# EAGLE board Clocks_Freq_Synth_board (EAGLE 9.6.2)
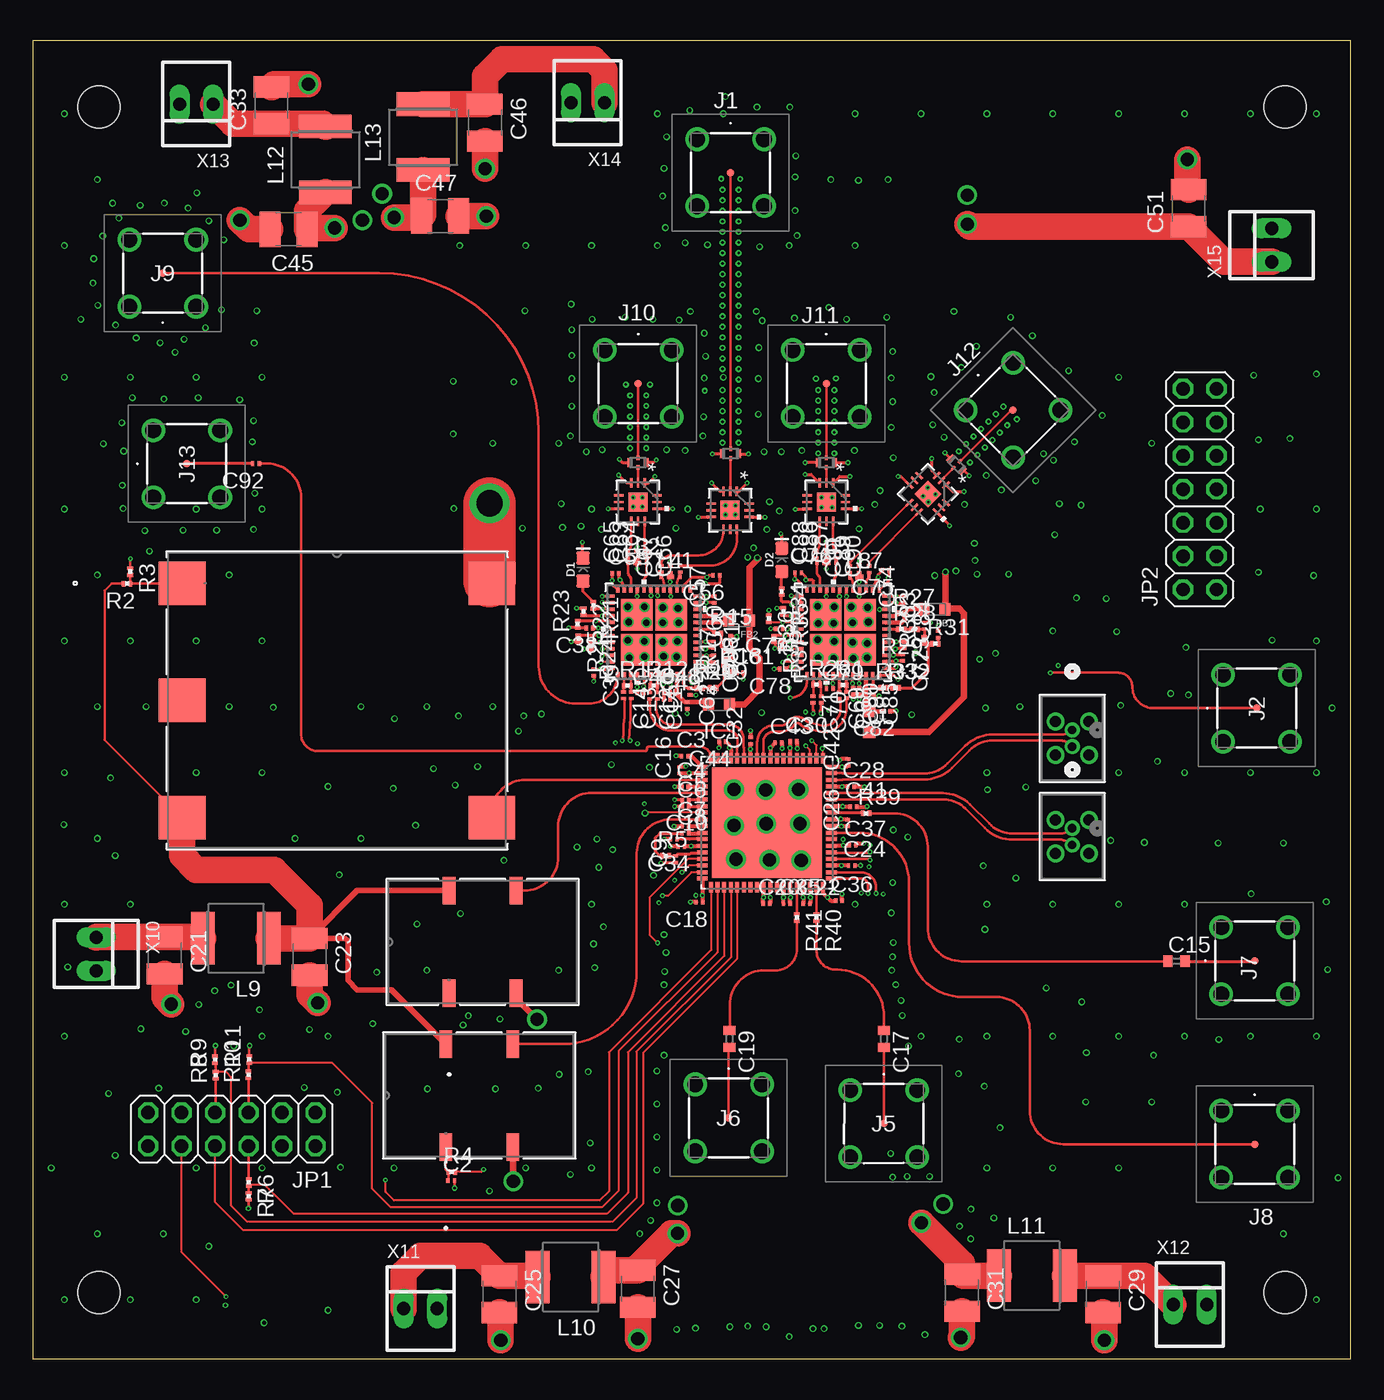
[diagram p3: board, top side]
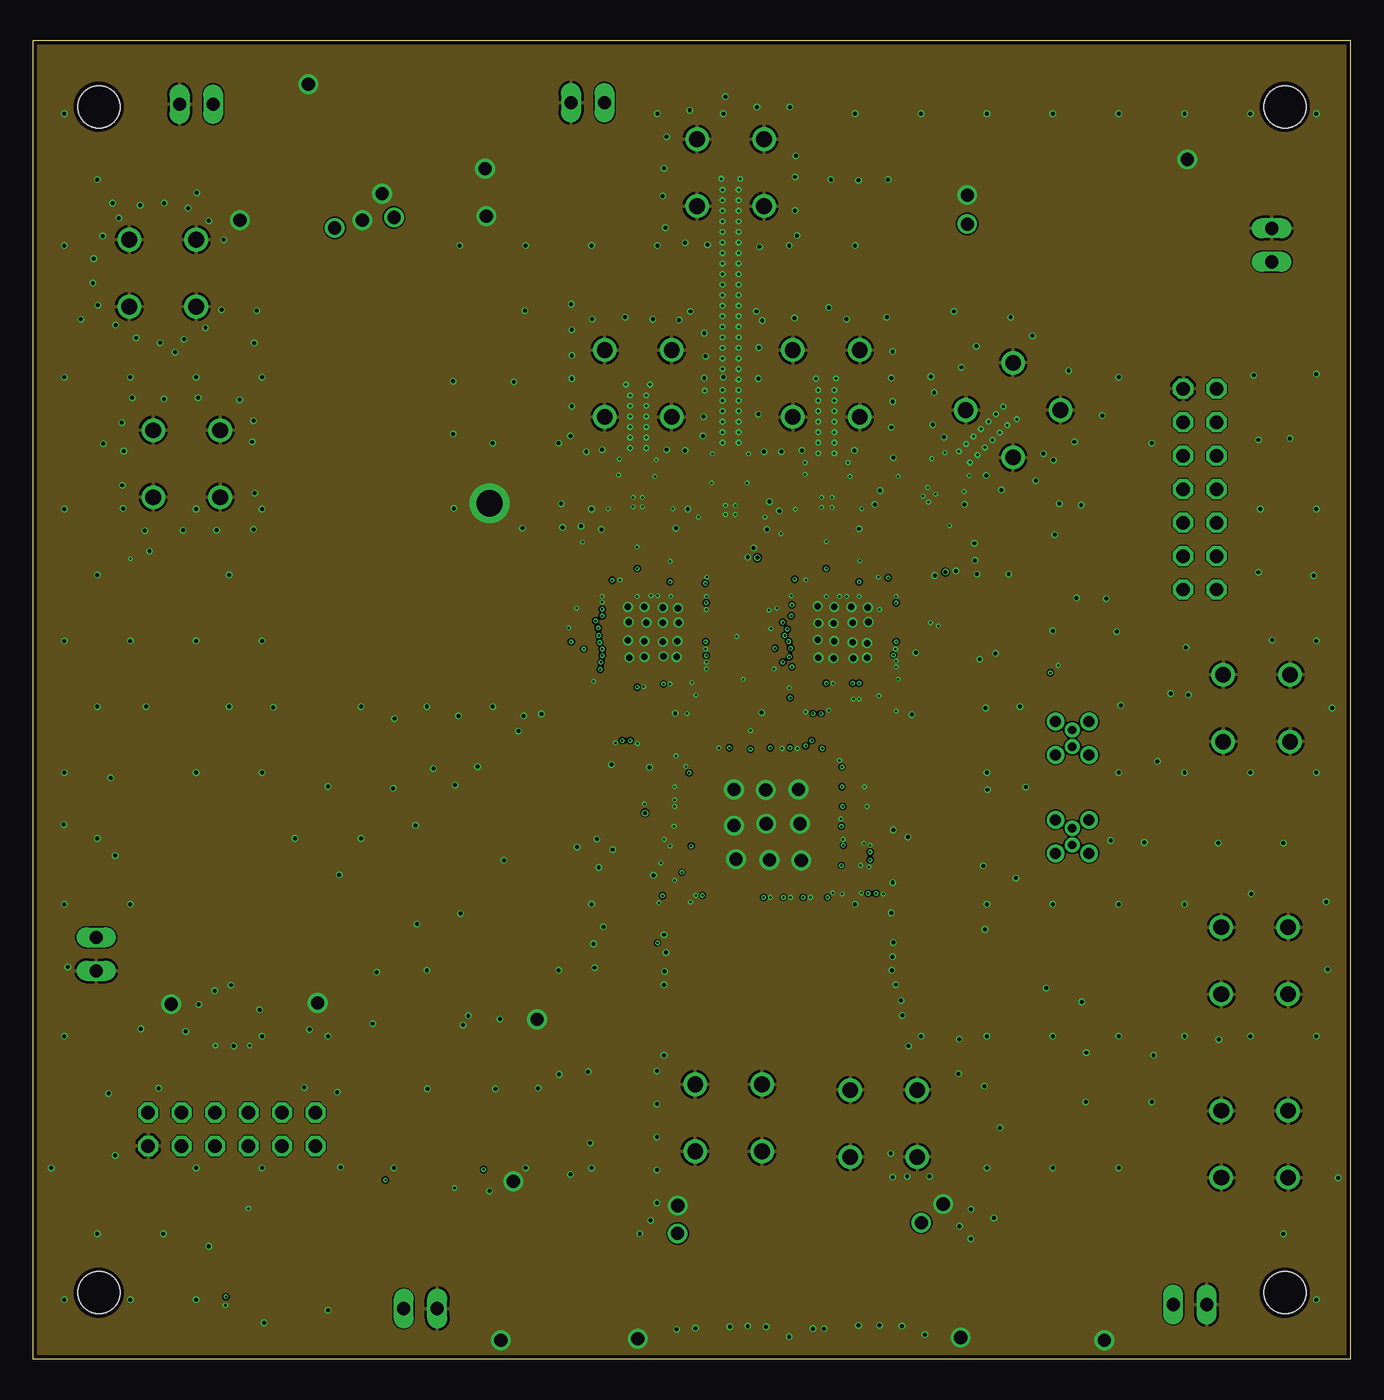
[diagram p4: board, inner layer Route2]
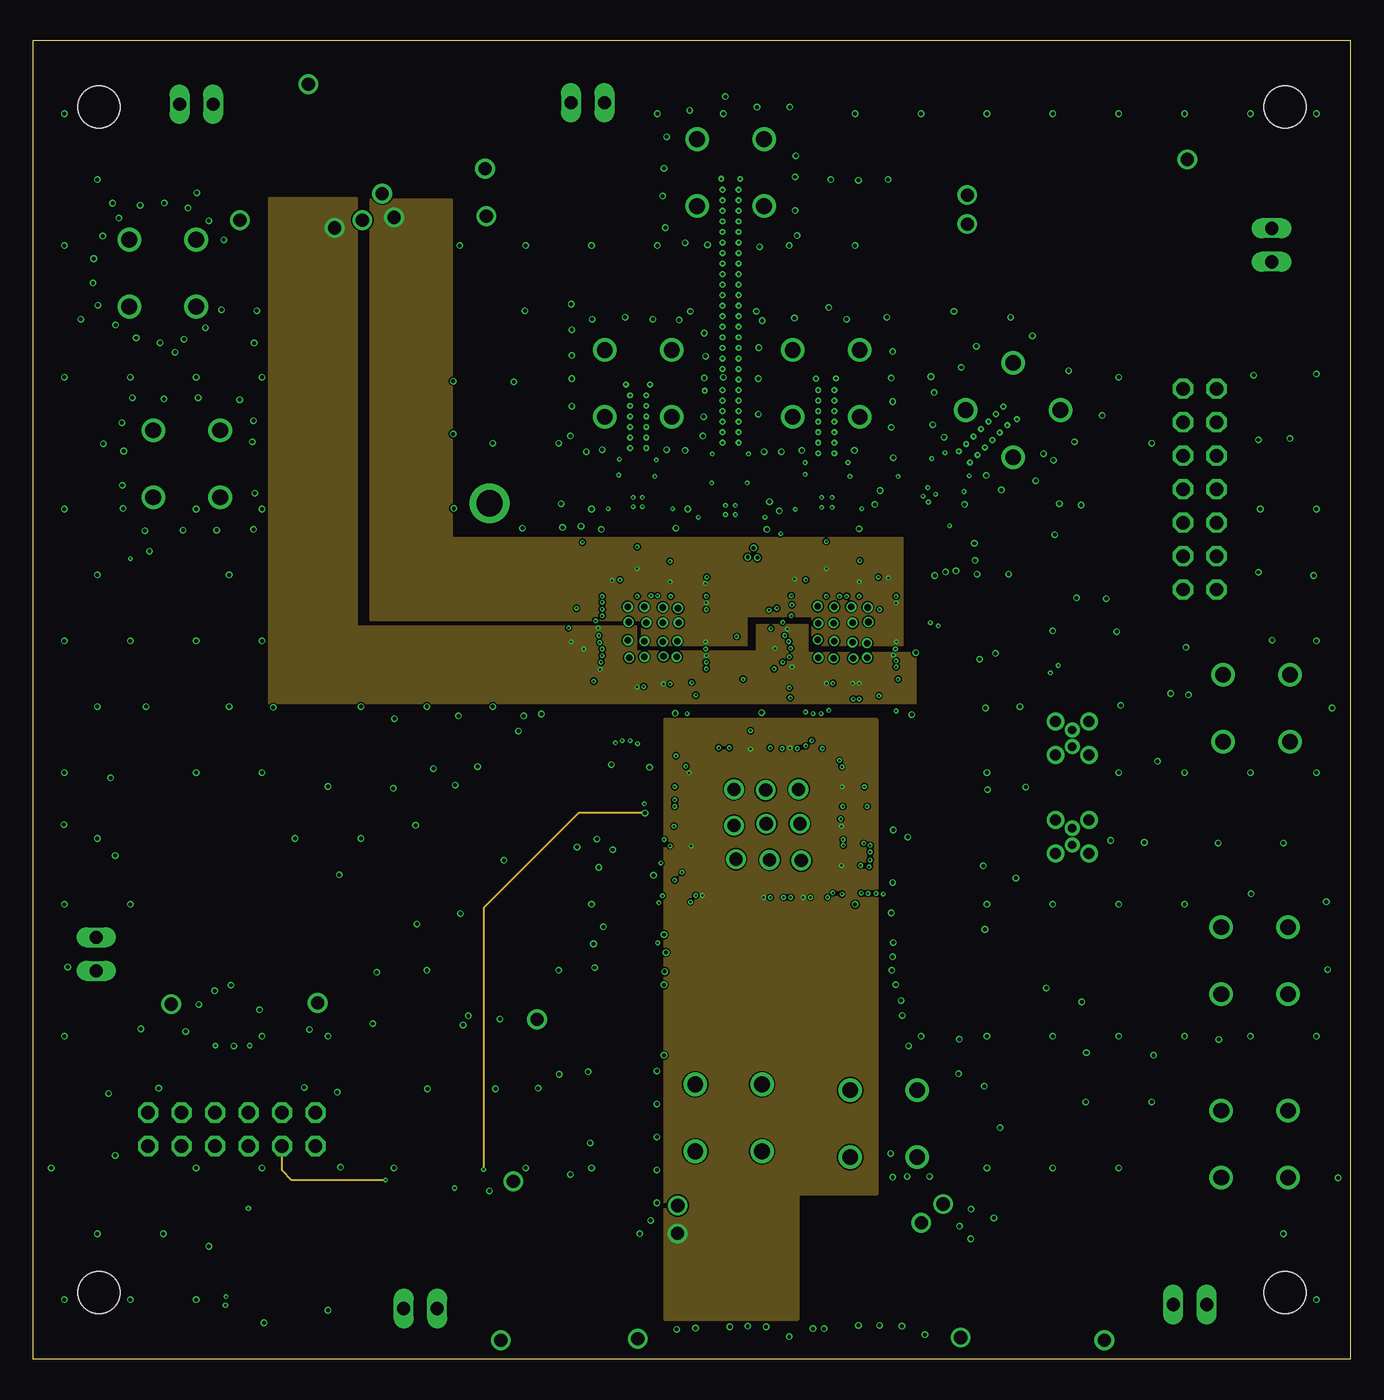
[diagram p5: board, inner layer Route3]
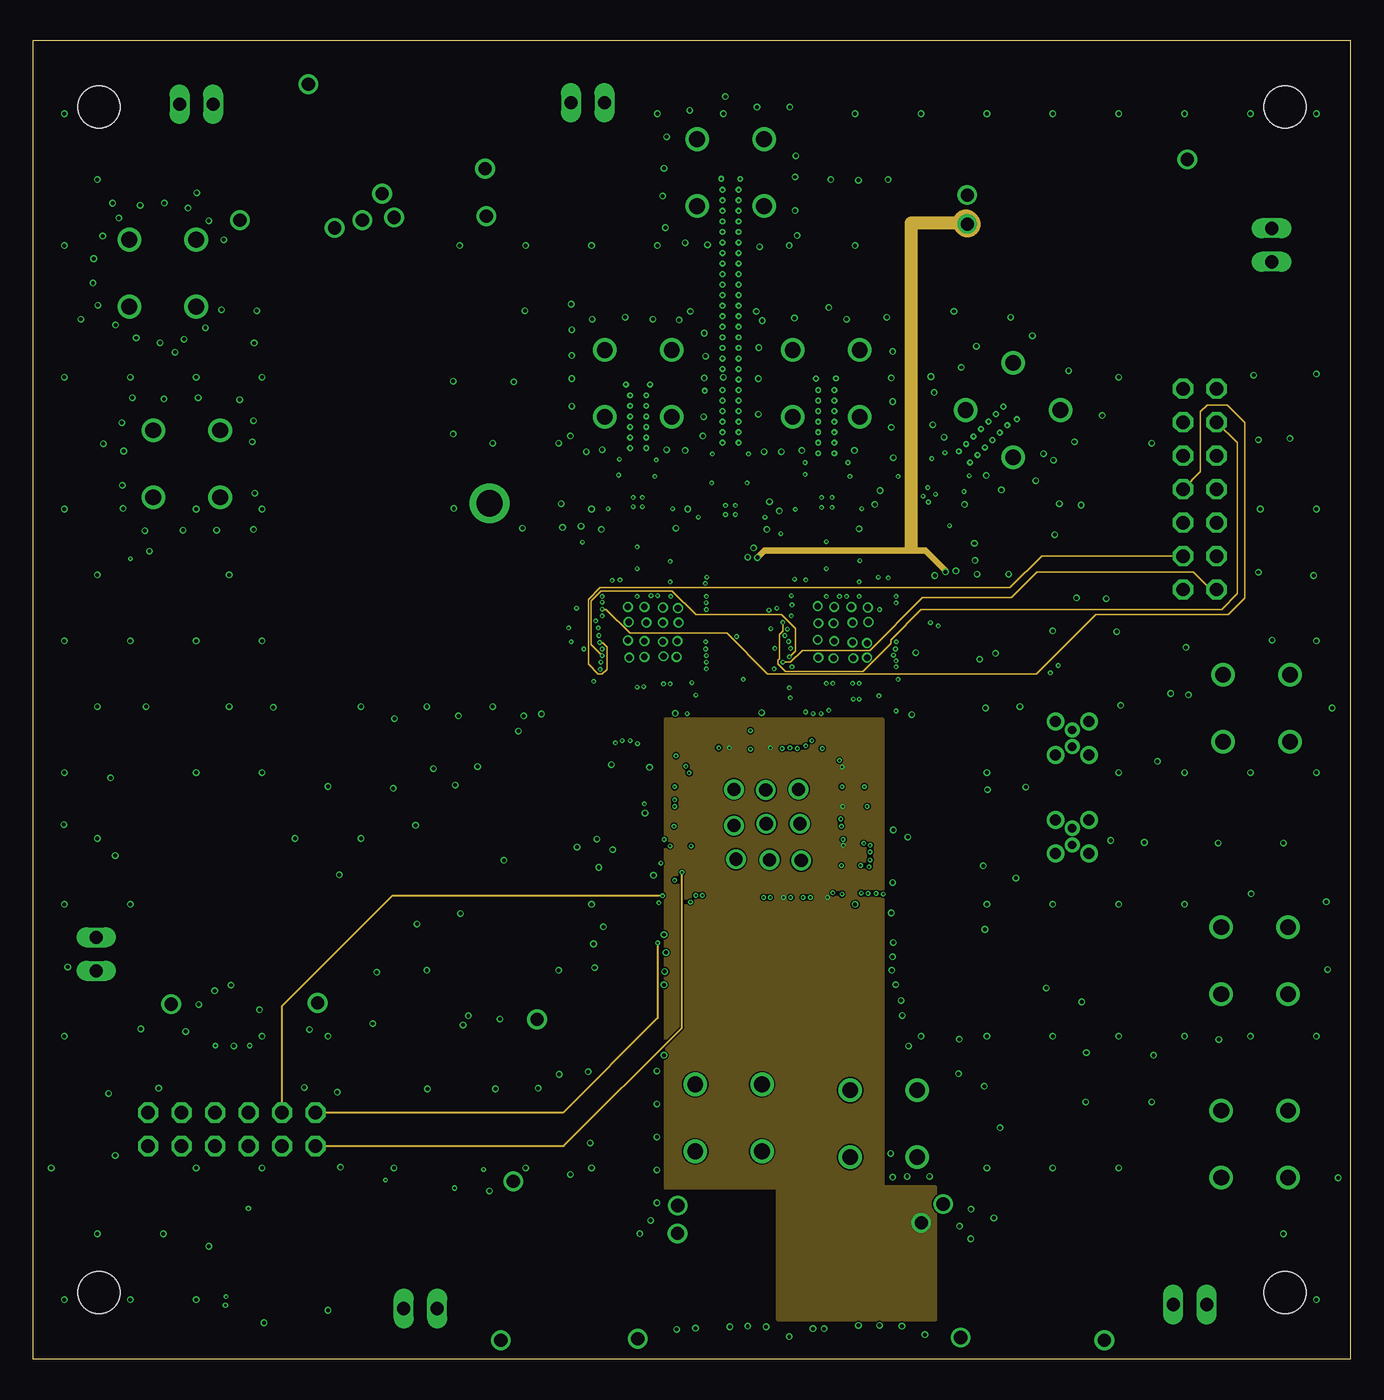
[diagram p6: board, inner layer Route14]
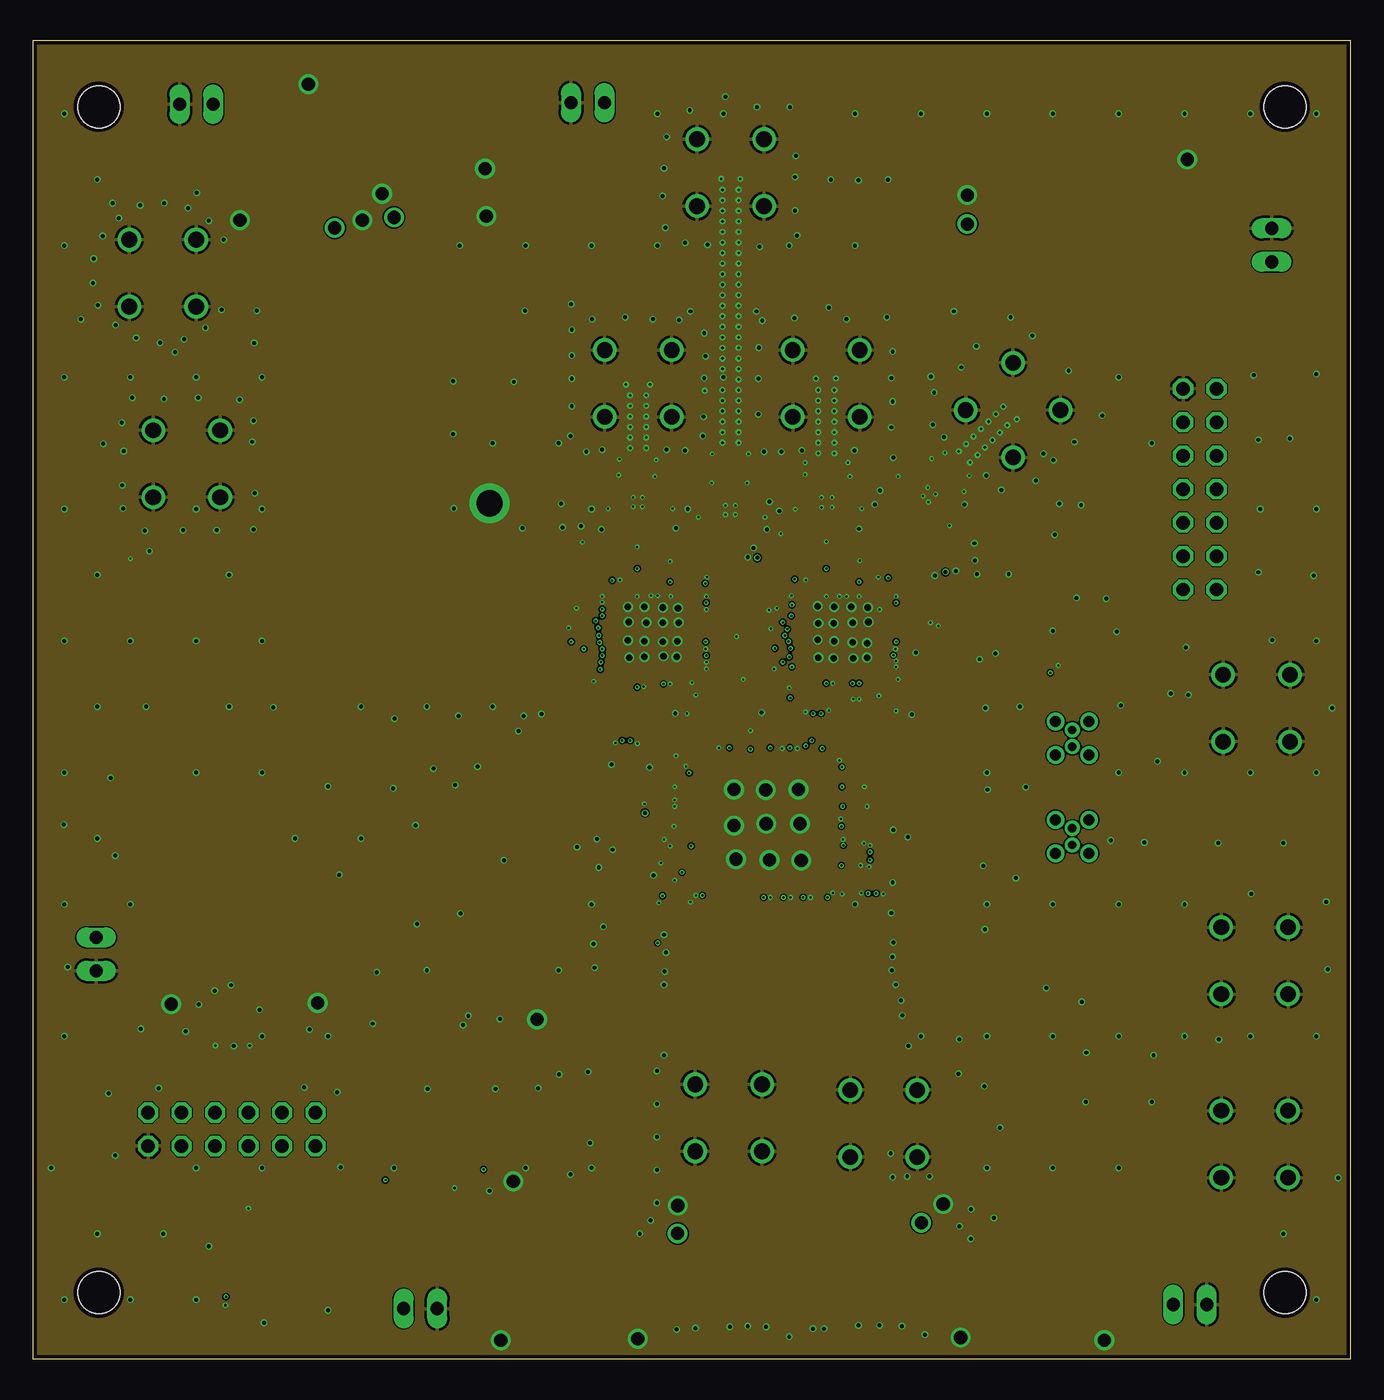
[diagram p7: board, inner layer Route15]
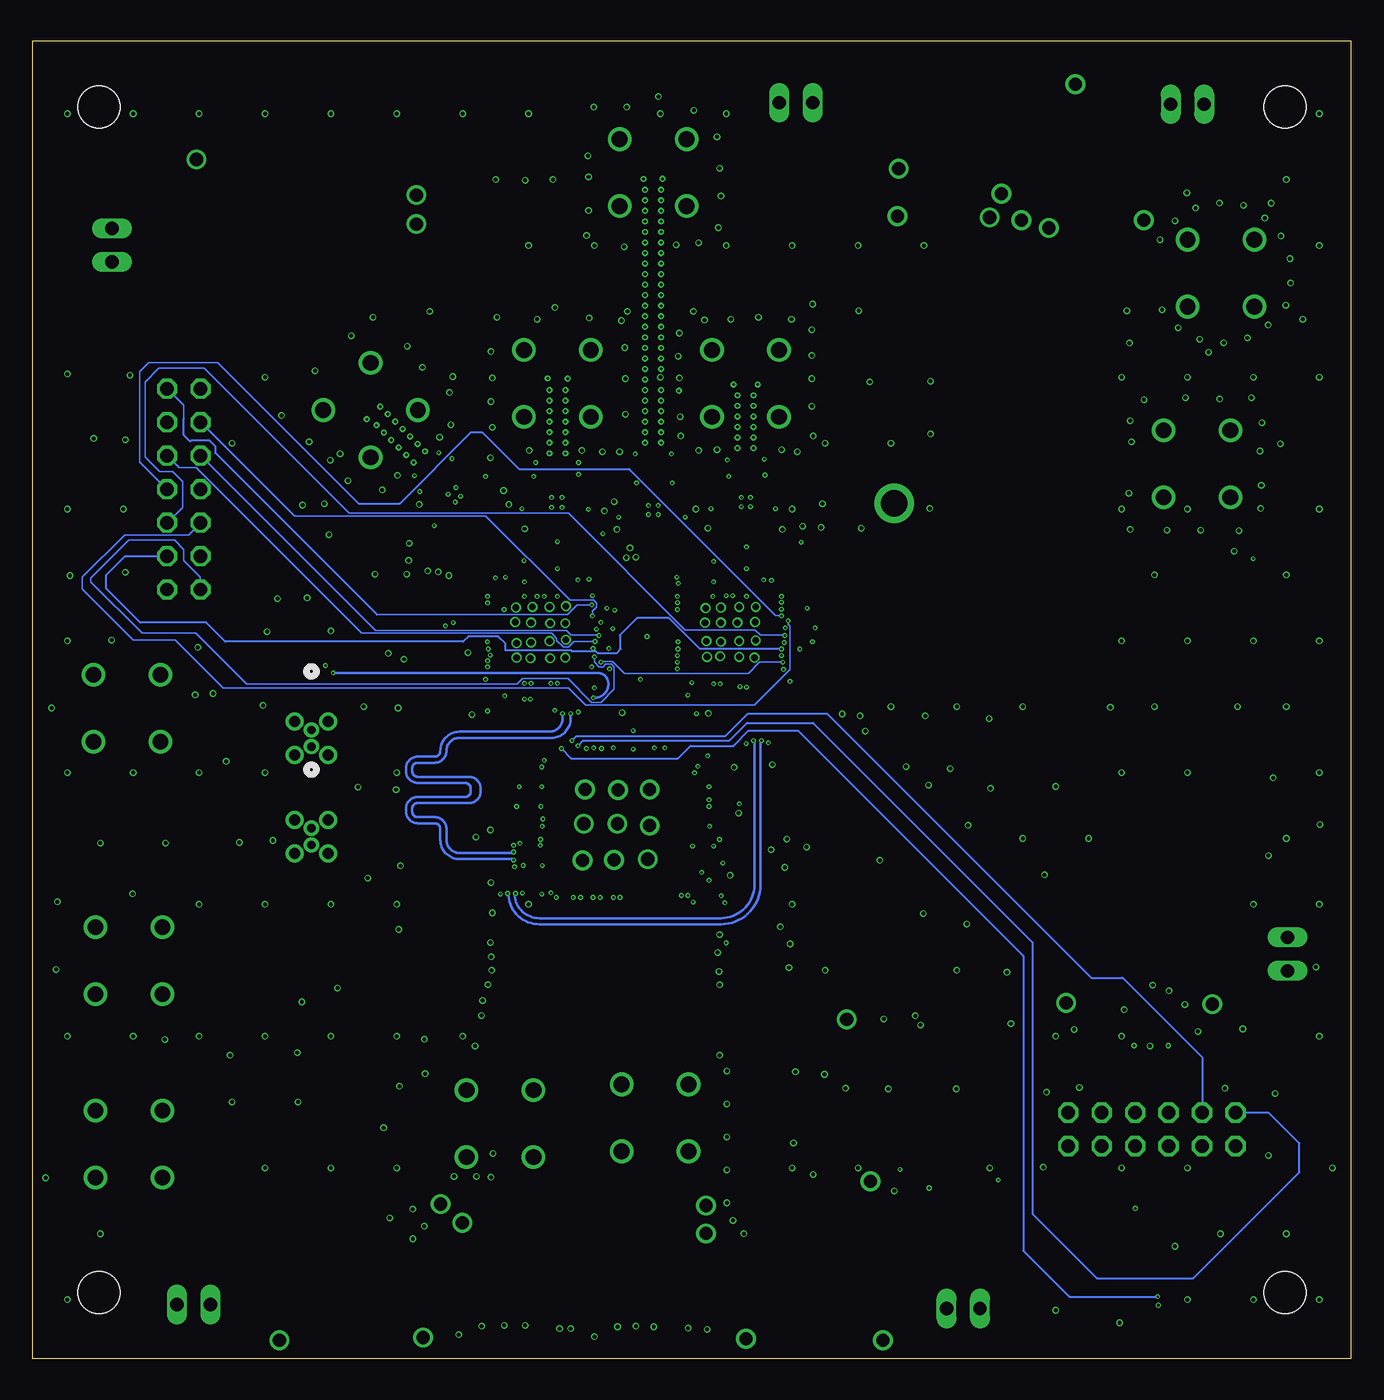
[diagram p8: board, bottom side, seen from below]

Size 100 x 100 mm. Coordinates in mm from the lower left corner, seen from the top.
Outline: 0,0 100,0 100,100 0,100 0,0
Copper layers (1+2*3+14*15+16): Top 0.035mm / dielectric 0.11mm / Route2 0.035mm / dielectric 0.6mm / Route3 0.035mm / dielectric 0.11mm / Route14 0.035mm / dielectric 0.6mm / Route15 0.035mm / dielectric 0.11mm / Bottom 0.035mm
Design rules "PCBWay_6L_100um-Track *": minimum track width 0.1mm, minimum drill 0.15mm, track to track 0.1mm, track to pad 0.1mm, pad to pad 0.1mm, via to via 0.1mm, smd to smd 0mil, copper to edge 0.3mm, drill to drill 10mil, minimum pad ring 6mil, minimum via ring 0.1mm, stop-mask expansion 2mil, vias tented up to drill 0.45mm, thermal gap 0.2mm
Net classes: 1 Differential: width 0.204 mm, clearance 0.1 mm to class 0, clearance 0.15 mm
Holes 3.2 mm at 5,5 95,5 95,95 5,95

## Footprints (pad centres in the part's own frame; a part is rotated, then mirrored left to right if it is on the bottom)
C0201 = smd 0.25 x 0.35: 1 -0.25,0; 2 0.25,0
C0402 = smd 0.7 x 0.9: 1 -0.65,0; 2 0.65,0
C1210 = smd 1.6 x 2.7: 1 -1.4,0; 2 1.4,0
LED-0603 = smd 1 x 1: A -0.877,0; C 0.877,0
BEADC1608X90N = smd 0.84 x 0.93: 1 -0.795,0; 2 0.795,0
QFN50P1000X1000X100-73N = smd 0.813 x 0.305: 1 -4.902,4.242; 2 -4.902,3.759; 3 -4.902,3.251; 4 -4.902,2.743; 5 -4.902,2.261; 6 -4.902,1.753; 7 -4.902,1.245; 8 -4.902,0.762; 9 -4.902,0.254; 10 -4.902,-0.254; 11 -4.902,-0.762; 12 -4.902,-1.245; 13 -4.902,-1.753; 14 -4.902,-2.261; 15 -4.902,-2.743; 16 -4.902,-3.251; 17 -4.902,-3.759; 18 -4.902,-4.242; 37 4.902,-4.242; 38 4.902,-3.759; 39 4.902,-3.251; 40 4.902,-2.743; 41 4.902,-2.261; 42 4.902,-1.753; 43 4.902,-1.245; 44 4.902,-0.762; 45 4.902,-0.254; 46 4.902,0.254; 47 4.902,0.762; 48 4.902,1.245; 49 4.902,1.753; 50 4.902,2.261; 51 4.902,2.743; 52 4.902,3.251; 53 4.902,3.759; 54 4.902,4.242 | smd 0.305 x 0.813: 19 -4.242,-4.902; 20 -3.759,-4.902; 21 -3.251,-4.902; 22 -2.743,-4.902; 23 -2.261,-4.902; 24 -1.753,-4.902; 25 -1.245,-4.902; 26 -0.762,-4.902; 27 -0.254,-4.902; 28 0.254,-4.902; 29 0.762,-4.902; 30 1.245,-4.902; 31 1.753,-4.902; 32 2.261,-4.902; 33 2.743,-4.902; 34 3.251,-4.902; 35 3.759,-4.902; 36 4.242,-4.902; 55 4.242,4.902; 56 3.759,4.902; 57 3.251,4.902; 58 2.743,4.902; 59 2.261,4.902; 60 1.753,4.902; 61 1.245,4.902; 62 0.762,4.902; 63 0.254,4.902; 64 -0.254,4.902; 65 -0.762,4.902; 66 -1.245,4.902; 67 -1.753,4.902; 68 -2.261,4.902; 69 -2.743,4.902; 70 -3.251,4.902; 71 -3.759,4.902; 72 -4.242,4.902 | smd 8.357 x 8.357: 73 0,0
1420731211 = smd 0.559 x 0.559: 1 0,0 | drill 1.194 pad 1.791: 2 -2.54,2.54; 3 -2.54,-2.54; 4 2.54,-2.54; 5 2.54,2.54
CONN_CJT-T-P-XX-ST-TH1_SAI = drill 0.635 pad 1.143: 1 0,0; 2 1.27,0 | drill 0.838 pad 1.346: 3 -0.635,1.27; 4 1.905,1.27; 5 -0.635,-1.27; 6 1.905,-1.27
2X06 = drill 1.016 octagon: 1 -6.35,-1.27; 2 -6.35,1.27; 3 -3.81,-1.27; 4 -3.81,1.27; 5 -1.27,-1.27; 6 -1.27,1.27; 7 1.27,-1.27; 8 1.27,1.27; 9 3.81,-1.27; 10 3.81,1.27; 11 6.35,-1.27; 12 6.35,1.27
2X07 = drill 1.016 octagon: 1 -7.62,-1.27; 2 -7.62,1.27; 3 -5.08,-1.27; 4 -5.08,1.27; 5 -2.54,-1.27; 6 -2.54,1.27; 7 0,-1.27; 8 0,1.27; 9 2.54,-1.27; 10 2.54,1.27; 11 5.08,-1.27; 12 5.08,1.27; 13 7.62,-1.27; 14 7.62,1.27
L0201 = smd 0.25 x 0.35: 1 -0.275,0; 2 0.275,0
L5650M = smd 1.8 x 4: 1 -2.5,0; 2 2.5,0
R0201 = smd 0.28 x 0.43: 1 -0.255,0; 2 0.255,0
CC-48-10_ADI = smd 0.457 x 0.254: 1 -3.226,2.75; 2 -3.226,2.25; 3 -3.226,1.75; 4 -3.226,1.25; 5 -3.226,0.75; 6 -3.226,0.25; 7 -3.226,-0.25; 8 -3.226,-0.75; 9 -3.226,-1.25; 10 -3.226,-1.75; 11 -3.226,-2.25; 12 -3.226,-2.75; 25 3.226,-2.75; 26 3.226,-2.25; 27 3.226,-1.75; 28 3.226,-1.25; 29 3.226,-0.75; 30 3.226,-0.25; 31 3.226,0.25; 32 3.226,0.75; 33 3.226,1.25; 34 3.226,1.75; 35 3.226,2.25; 36 3.226,2.75 | smd 0.254 x 0.457: 13 -2.75,-3.226; 14 -2.25,-3.226; 15 -1.75,-3.226; 16 -1.25,-3.226; 17 -0.75,-3.226; 18 -0.25,-3.226; 19 0.25,-3.226; 20 0.75,-3.226; 21 1.25,-3.226; 22 1.75,-3.226; 23 2.25,-3.226; 24 2.75,-3.226; 37 2.75,3.226; 38 2.25,3.226; 39 1.75,3.226; 40 1.25,3.226; 41 0.75,3.226; 42 0.25,3.226; 43 -0.25,3.226; 44 -0.75,3.226; 45 -1.25,3.226; 46 -1.75,3.226; 47 -2.25,3.226; 48 -2.75,3.226 | smd 2.388 x 2.388: 49 -1.312,1.312; 50 -1.312,-1.312; 51 1.312,-1.312; 52 1.312,1.312
DQ1225_MNC = smd 0.711 x 0.178: 1 -1.448,0.508; 2 -1.448,0; 3 -1.448,-0.508; 7 1.448,-0.508; 8 1.448,0; 9 1.448,0.508 | smd 0.178 x 0.711: 4 -0.508,-1.448; 5 0,-1.448; 6 0.508,-1.448; 10 0.508,1.448; 11 0,1.448; 12 -0.508,1.448 | smd 1.448 x 1.448: 13 0,0
SMT_DB-FD-T05_SUS = smd 0.203 x 0.356: 1 0,0.356; 2 0,-0.356 | smd 0.356 x 0.66: 3 -0.622,0; 4 0.622,0
SMD5_ECOC-2522_25P4X22_ECS = smd 3.556 x 3.302: 1 -11.75,8.89; 2 -11.75,0; 3 -11.75,-8.89; 4 11.75,-8.89; 5 11.75,8.89
SMD4_CVHD-950_CRX = smd 2.083 x 0.965: 1 -3.899,2.54; 2 -3.899,-2.54; 3 3.899,-2.54; 4 3.899,2.54
22-23-2021 = drill 1 long: 1 -1.27,0; 2 1.27,0

## Placement (x,y rotation side)
C1  10pF  [C0201]  48.37,59.91 90 top
C2  0.33µF  [C0201]  31.74,13.52 0 top
C3  0.47µf  [C0201]  49.46,45.72 0 top
C4  [C0201]  49.48,43.39 0 top
C5  [C0201]  49.52,42.39 0 top
C6  0.33µF  [C0201]  49.52,41.92 0 top
C7  [C0201]  49.51,40.39 0 top
C8  1000pF  [C0201]  49.51,39.87 0 top
C9  0.47µF  [C0201]  48.76,37.89 90 top
C10  0.47µF  [C0201]  48.63,39.42 0 top
C11  1µF  [C0201]  47.37,50.3 270 top
C12  1µF  [C0201]  46.81,50.3 270 top
C13  1µF  [C0201]  45.4,50.35 270 top
C14  1µF  [C0201]  44.82,50.35 270 top
C15  10nF  [C0402]  86.78,30.16 0 top
C16  0.1µF  [C0201]  49.07,44.65 90 top
C17  10nF  [C0402]  64.58,24.27 270 top
C18  0.1µF  [C0201]  50.57,34.64 180 top
C19  10nF  [C0402]  52.86,24.27 270 top
C20  0.1µF  [C0201]  55.66,34.54 0 top
C21  22µF  [C1210]  10,30.6 270 top
C22  0.1µF  [C0201]  58.71,34.53 0 top
C23  10µF  [C1210]  21,30.5 270 top
C24  0.1µF  [C0201]  62.13,37.42 0 top
C25  22µF  [C1210]  35.4,4.9 270 top
C26  0.1µF  [C0201]  61.84,40.65 90 top
C27  10µF  [C1210]  45.9,5.3 270 top
C28  0.1µF  [C0201]  62.06,43.41 0 top
C29  22µF  [C1210]  81.2,4.9 270 top
C30  0.1µF  [C0201]  57.71,46.83 0 top
C31  10µF  [C1210]  70.5,5 270 top
C32  0.1µF  [C0201]  54.48,46.9 90 top
C33  22µF  [C1210]  18.1,95.1 90 top
C34  0.1µF  [C0201]  49.2,38.86 180 top
C35  0.1µF  [C0201]  57.21,34.54 0 top
C36  0.1µF  [C0201]  61.16,34.74 0 top
C37  0.1µF  [C0201]  62.2,38.96 0 top
C38  4.7µF  [C0201]  42.23,55.44 180 top
C39  4.7µF  [C0201]  42.56,52.07 270 top
C40  4.7µF  [C0201]  46.11,50.52 0 top
C41  0.1µF  [C0201]  62.26,41.88 0 top
C42  0.1µF  [C0201]  61.85,45.25 90 top
C43  0.1µF  [C0201]  56.56,46.73 0 top
C44  0.1µF  [C0201]  52.33,46.82 180 top
C45  10µF  [C1210]  19.4,85.7 180 top
C46  22µF  [C1210]  34.3,93.8 270 top
C47  10µF  [C1210]  30.9,86.7 0 top
C48  4.7µF  [C0201]  48.11,50.54 0 top
C49  4.7µF  [C0201]  48.11,50.06 0 top
C50  4.7µF  [C0201]  51.64,53.12 270 top
C51  22µF  [C1210]  87.7,87.3 90 top
C55  4.7µF  [C0201]  44.21,59.6 0 top
C56  4.7µF  [C0201]  51.86,59.44 180 top
C57  4.7µF  [C0201]  51.69,57.6 90 top
C58  4.7µF  [C0201]  51.62,54.17 270 top
C59  1µF  [C0201]  49.65,49.57 90 top
C60  31pF  [C0201]  52.95,54.6 90 top
C61  10nF  [C0201]  53.66,52.04 0 top
C62  10pF  [C0201]  49.86,50.62 270 top
C63  10pF  [C0201]  45.84,61 90 top
C64  0.1µF  [C0201]  46.57,61 90 top
C65  0.1µF  [C0201]  45.15,61 90 top
C66  0.1µF  [C0201]  49.11,59.94 90 top
C67  0.1µF  [C0201]  47.66,59.94 90 top
C68  1µF  [C0201]  61.74,50.36 270 top
C69  1µF  [C0201]  61.19,50.33 270 top
C70  1µF  [C0201]  59.81,50.02 270 top
C71  1µF  [C0201]  59.19,50.02 270 top
C72  4.7µF  [C0201]  66,53.21 270 top
C73  4.7µF  [C0201]  66.1,54.16 270 top
C74  4.7µF  [C0201]  66.04,57.61 90 top
C75  4.7µF  [C0201]  64.72,59.83 180 top
C76  4.7µF  [C0201]  58.07,59.64 0 top
C77  4.7µF  [C0201]  56.62,55.38 180 top
C78  4.7µF  [C0201]  56.92,52.33 180 top
C79  4.7µF  [C0201]  60.47,50.84 0 top
C80  4.7µF  [C0201]  62.25,50.66 270 top
C81  4.7µF  [C0201]  62.7,50.66 270 top
C82  1µF  [C0201]  64.8,49.14 180 top
C83  31pF  [C0201]  67.62,55.61 90 top
C84  10nF  [C0201]  68.7,54.96 90 top
C85  10pF  [C0201]  63.74,50.66 270 top
C86  10pF  [C0201]  60.2,61 90 top
C87  0.1µF  [C0201]  60.94,61 90 top
C88  0.1µF  [C0201]  59.44,61 90 top
C89  10pF  [C0201]  62.7,59.91 90 top
C90  0.1µF  [C0201]  63.47,59.91 90 top
C91  0.1µF  [C0201]  61.97,59.91 90 top
C92  0.1µf  [C0201]  16.93,67.92 180 top
D1  Green  [LED-0603]  41.75,59.88 90 top
D2  Green  [LED-0603]  56.83,60.61 90 top
FB1  FBMH1608HL601-T  [BEADC1608X90N]  68.41,56.87 180 top
FB2  FBMH1608HL601-T  [BEADC1608X90N]  53.58,56.01 180 top
FB3  FBMH1608HL601-T  [BEADC1608X90N]  52.06,49.65 0 top
FB4  FBMH1608HL601-T  [BEADC1608X90N]  63.46,48.33 270 top
IC1  AD9523BCPZ  [QFN50P1000X1000X100-73N]  55.7,40.67 0 top
J1  142-0731-211  [1420731211]  52.94,90 0 top
J2  142-0731-211  [1420731211]  92.86,49.36 90 top
J3  CJT-T-P-HH-ST-TH1  [CONN_CJT-T-P-XX-ST-TH1_SAI]  78.87,47.71 270 top
J4  CJT-T-P-HH-ST-TH1  [CONN_CJT-T-P-XX-ST-TH1_SAI]  78.87,40.25 270 top
J5  142-0731-211  [1420731211]  64.56,17.84 0 top
J6  142-0731-211  [1420731211]  52.79,18.27 0 top
J7  142-0731-211  [1420731211]  92.71,30.2 90 top
J8  142-0731-211  [1420731211]  92.71,16.28 0 top
J9  142-0731-211  [1420731211]  9.85,82.37 180 top
J10  142-0731-211  [1420731211]  45.93,74 0 top
J11  142-0731-211  [1420731211]  60.2,74 0 top
J12  142-0731-211  [1420731211]  74.38,71.98 45 top
J13  142-0731-211  [1420731211]  11.67,67.91 90 top
JP1  [2X06]  15.09,17.4 180 top
JP2  [2X07]  88.55,65.98 90 top
L1  1.3nH  [L0201]  48.8,59.32 0 top
L2  1.3nH  [L0201]  46.29,60.4 0 top
L3  1.3nH  [L0201]  45.44,60.4 0 top
L4  1.3nH  [L0201]  47.95,59.32 0 top
L5  1.3nH  [L0201]  60.67,60.4 0 top
L6  1.3nH  [L0201]  59.77,60.4 0 top
L7  1.3nH  [L0201]  63.17,59.31 0 top
L8  1.3nH  [L0201]  62.27,59.31 0 top
L9  [L5650M]  15.4,31.9 180 top
L10  [L5650M]  40.8,6.2 180 top
L11  [L5650M]  75.8,6.3 0 top
L12  [L5650M]  22.2,91 90 top
L13  [L5650M]  29.6,92.7 90 top
R1  100R  [R0201]  61.47,51.11 0 top
R2  1k  [R0201]  7.14,58.81 180 top
R3  1k  [R0201]  7.38,59.72 270 top
R4  1k  [R0201]  31.78,14.16 0 top
R5  0R  [R0201]  48.02,38.16 0 top
R6  0.65k  [R0201]  16.38,13.37 270 top
R7  1k  [R0201]  16.37,12.32 270 top
R8  0.65k  [R0201]  13.86,21.5 90 top
R9  1k  [R0201]  13.82,22.69 90 top
R10  0.65k  [R0201]  16.36,21.55 90 top
R11  1k  [R0201]  16.42,22.7 90 top
R12  100R  [R0201]  47.11,51.07 0 top
R13  100R  [R0201]  45.11,51.07 0 top
R14  0R  [R0201]  51.74,56.17 270 top
R15  0R  [R0201]  51.96,55.04 0 top
R16  931R  [R0201]  52.78,53.71 180 top
R17  30R  [R0201]  52.48,52.85 90 top
R18  330R  [R0201]  52.71,52.07 0 top
R19  0R  [R0201]  51.62,50.89 0 top
R20  0R  [R0201]  50.61,50.88 0 top
R21  500R  [R0201]  42.53,57.17 270 top
R22  200k  [R0201]  41.78,56.69 270 top
R23  200k  [R0201]  41.34,55.73 90 top
R24  200k  [R0201]  42.32,54.09 270 top
R25  200k  [R0201]  41.39,54.64 270 top
R26  100R  [R0201]  59.47,51.16 0 top
R27  0R  [R0201]  65.87,56.55 0 top
R28  0R  [R0201]  65.9,55.35 0 top
R29  931R  [R0201]  66.92,55.36 180 top
R30  30R  [R0201]  67.63,54.52 90 top
R31  330R  [R0201]  68.47,54.26 0 top
R32  0R  [R0201]  65.46,50.9 0 top
R33  0R  [R0201]  64.54,50.9 0 top
R34  500R  [R0201]  56.82,58.21 270 top
R35  200k  [R0201]  56.94,56.71 270 top
R36  200k  [R0201]  55.84,56.16 270 top
R37  200k  [R0201]  56.84,54.16 270 top
R38  200k  [R0201]  56.24,54.61 270 top
R39  22R  [R0201]  63.22,41.38 0 top
R40  22R  [R0201]  59.45,33.47 270 top
R41  22R  [R0201]  57.97,33.47 270 top
U1  ADF4382ABCCZ  [CC-48-10_ADI]  47.12,55.12 180 top
U2  MTX2-143+  [DQ1225_MNC]  45.91,65 270 top
U3  MTX2-143+  [DQ1225_MNC]  52.91,64.38 270 top
U4  ATS1005-3DB-FD-T05  [SMT_DB-FD-T05_SUS]  45.91,68 180 top
U5  ATS1005-3DB-FD-T05  [SMT_DB-FD-T05_SUS]  52.94,68.68 180 top
U6  ADF4382ABCCZ  [CC-48-10_ADI]  61.48,55.12 180 top
U7  MTX2-143+  [DQ1225_MNC]  60.21,65 270 top
U8  ATS1005-3DB-FD-T05  [SMT_DB-FD-T05_SUS]  60.2,68 180 top
U9  MTX2-143+  [DQ1225_MNC]  67.91,65.62 225 top
U10  ATS1005-3DB-FD-T05  [SMT_DB-FD-T05_SUS]  70.09,67.84 135 top
X4  ECOC-2522-100.000-3HC  [SMD5_ECOC-2522_25P4X22_ECS]  23.07,49.95 0 top
X5  CVHD-950-50.000  [SMD4_CVHD-950_CRX]  34.12,31.62 90 top
X6  CVHD-950-50.000  [SMD4_CVHD-950_CRX]  33.87,19.97 90 top
X10  22-23-2021  [22-23-2021]  4.8,30.7 270 top
X11  22-23-2021  [22-23-2021]  29.4,3.8 0 top
X12  22-23-2021  [22-23-2021]  87.8,4.1 0 top
X13  22-23-2021  [22-23-2021]  12.4,95.2 180 top
X14  22-23-2021  [22-23-2021]  42.1,95.3 180 top
X15  22-23-2021  [22-23-2021]  94,84.5 90 top

## Tracks (layer width: path | path; a pad name or v marks a point on that pad's centre or on a via)
10MHZ_OUT
  Top 0.204: X4.4 34.82,41.38 arc-90 37.36,43.92 IC1.3
100MHZ_OUT
  Top 0.204: IC1.5 42.39,42.93 arc90 39.85,40.39 39.85,38.06 arc-90 37.31,35.52 X5.3
+1V8_CLOCK  (via drill 0.15, 1)
  Top 0.3: C35.1 v56.96,34.99 v56.95,35 IC1.30 | IC1.36 59.94,35.36 v60.3,35 60.56,34.74 C36.1 | IC1.42 61.47,38.92 v61.5,38.95 v61.51,38.96 C37.1 | IC1.48 60.62,41.9 v61.45,41.9 61.99,41.9 C41.1 | IC1.54 60.61,44.9 v61.4,44.9 61.75,44.9 C42.1 | C43.1 56.31,46.71 v55.95,46.35 IC1.63 | IC1.69 52.96,46.24 v52.85,46.35 52.85,46.55 C44.1
  Top 2: v67.41,10.31 70.5,7.22 C31.1 70.6,6.3 L11.1
  pour Route14: 59,3 68.5,3 68.5,12.5 68.5,13 64.5,13 64.5,48.5 48,48.5 48,13 56.5,13 56.5,3
+3V3_CLOCK  (via drill 0.15, 1)
  Top 0.3: IC1.2 50.78,44.45 v49.8,44.45 49.75,44.4 C16.1 | IC1.13 49.97,38.92 v49.95,38.9 49.91,38.86 C34.1 | IC1.18 v50.8,35.15 50.82,35.13 C18.1 | IC1.27 v55.45,35 55.41,34.96 C20.1 | IC1.33 v58.45,35 v58.46,34.99 C22.1 | IC1.39 v61.35,37.42 C24.1 | IC1.45 60.62,40.4 v61.35,40.4 C26.1 | IC1.51 61.39,43.41 v61.39,43.41 | v61.39,43.41 v61.4,43.4 | C28.1 v61.39,43.41 | C30.1 v57.46,46.36 v57.45,46.35 IC1.60 | IC1.66 v54.45,46.25 54.45,46.62 C32.1
  Top 2: L10.1 43.8,6.7 C27.1 45.9,6.95 48.45,9.5 v48.92,9.5
  pour Route3: 48,48.5 64,48.5 64,12.5 58,12.5 58,3 57.5,3 48,3
+3V3_LO_1  (via drill 0.15, 1)
  Top 0.22: U1.3 51.08,53.37 v51.1,53.35 51.12,53.37 C50.1 | C38.1 v42.89,55.44 v42.9,55.45 43.81,55.45 U1.30 | R25.2 40.87,54.38 v40.85,54.4 | v41.8,53.85 42.3,53.85 R24.2 | U1.36 43.82,52.3 v43.05,52.3 42.58,52.3 C39.1 | U1.40 45.87,50.97 v45.85,50.95 C40.1 | C49.1 C48.1 v47.86,51.19 v47.85,51.2 | U6.3 64.73,53.39 v65.3,53.39 65.93,53.39 C72.1 | U6.30 57.27,55.37 v57.25,55.35 56.9,55.35 C77.1 | R38.2 56.3,54.3 v56.3,53.9 v56.3,53.91 R37.2 | U6.36 57.73,52.37 v57.6,52.5 57.34,52.5 C78.1 | C79.1 60.2,50.86 v60.2,51.25 60.2,51.86 U6.40 | U6.44 62.2,51.86 v62.2,51.25 62.25,51.2 C80.1 | U6.45 62.7,51.86 v62.7,51.25 C81.1
  Top 0.3: v47.85,51.2 47.85,51.87 U1.44 U1.45
  Top 2: L12.1 20.8,87.1 C45.1 20.9,85.8 v22.9,85.8
  pour Route3: 17.9,88.1 24.6,88.1 24.6,55.6 45.8,55.6 45.8,53.7 54.9,53.7 54.9,55.7 58.8,55.7 58.8,53.6 67,53.6 67,49.7 17.9,49.7
+3V3_LO_2  (via drill 0.15, 1)
  Top 0.22: C55.1 v43.96,59.06 43.96,58.76 U1.24 | U1.13 50.3,58.78 50.97,58.78 v51.02,58.83 51.07,58.78 52.01,58.78 52.12,58.89 C56.1 | C57.1 51.67,57.37 v51.1,57.37 v51.09,57.36 U1.11 | C58.1 51.6,54.4 v51.05,54.4 51.02,54.37 U1.5 | L3.2 45.85,60.4 | 45.85,60.4 L2.1 | C63.1 arc-45 45.85,60.73 45.85,60.4 | v45.85,59.95 45.85,60.4 | L4.2 48.4,59.32 | 48.4,59.32 L1.1 | C1.1 48.4,59.63 48.4,59.32 | v48.35,58.95 48.35,59.27 48.4,59.32 | L6.2 60.2,60.4 | 60.2,60.4 L5.1 | C86.1 60.2,60.4 | v60.2,59.95 60.2,60.4 | L8.2 62.75,59.31 | 62.75,59.31 L7.1 | C89.1 62.75,59.61 62.75,59.31 | v62.7,58.95 62.7,59.26 62.75,59.31 | C76.1 57.82,59.17 v57.8,59.15 57.93,59.15 U6.24 | C75.1 64.97,59.32 v64.9,59.25 64.9,59.02 U6.13 | U6.11 65.48,57.37 v65.5,57.35 C74.1 | U6.5 65.48,54.37 v65.51,54.4 v65.52,54.41 C73.1
  Top 2: L13.1 29.6,86.8 C47.1 29.4,86.6 v27.4,86.6
  pour Route3: 25.6,88 25.6,56 46.2,56 46.2,54.1 54.2,54.1 54.2,56.3 59.1,56.3 59.1,54.1 66,54.1 66,62.3 31.8,62.3 31.8,88
+3V3_XO
  Top 0.2: X4.3 5.45,46.93 5.45,58.3 5.96,58.81 R2.2
  Top 0.4: X5.4 24.62,35.52 C23.1 23.7,31.9 23.9,31.7 23.9,28.7 24.6,28 27.2,28 X6.4
  Top 2: L9.1 C23.1 21,34.4 18.3,37.1 12.4,37.1 11.32,38.18 X4.3
+5V0_LO  (via drill 0.3, 1)
  Top 0.5: v69.25,59.7 69.25,56.91 | 69.25,56.91 FB1.1 | FB4.2 67.98,47.53 70.65,50.2 70.65,56.55 70.28,56.91 69.25,56.91 | FB3.2 54,49.65 55.15,50.8 55.15,53.15 54.38,53.92 FB2.1 54.38,60.02 55.05,60.7 v54.98,60.77
  Top 2: X15.1 90.37,83.23 C51.1 71.1,85.9 v70.9,86.1
  Route14 0.5: 66.65,61.7 67.03,61.33 | v69.25,59.7 69.25,59.8 67.72,61.33 67.03,61.33 | v54.98,60.77 55.52,61.33 67.03,61.33
  Route14 1: 66.65,61.7 66.65,86.2 70.8,86.2
  Route14 2: 70.8,86.2 v70.9,86.1
AD9523_CS
  Top 0.2: R10.1 JP1.5
AD9523_EEPROM_SEL  (via drill 0.15)
  Top 0.15: IC1.57 58.95,46.2 v58.65,46.5
  Bottom 0.15: v58.65,46.5 58.25,46.9 47.15,46.9 45.8,48.25 40.8,48.25 24.15,31.6 24.15,11 19.25,6.1 11.95,6.1 3.9,14.15 3.9,16.35 6.22,18.67 JP1.11
AD9523_OUT0_N
  Top 0.204: IC1.67 53.95,46.39 53.92,46.39 53.92,47 arc90 52.81,48.11 48.49,48.11 arc-90 47.3,49.3 47.3,49.98 C11.2
AD9523_OUT0_P
  Top 0.204: IC1.68 53.44,46.39 53.46,46.39 53.46,47 arc90 52.81,47.65 48.49,47.65 arc-90 46.84,49.3 46.84,50.02 C12.2
AD9523_OUT1_N
  Top 0.204: IC1.64 55.45,46.39 55.42,46.39 55.42,46.8 arc-90 56.2,47.58 56.75,47.58 arc55 57.78,48.11 arc-98 58.23,48.15 arc24 58.82,47.79 59.95,47.54 arc90 61.74,49.33 C68.2 arc-90 C68.2
AD9523_OUT1_P
  Top 0.204: IC1.65 54.94,46.39 54.96,46.39 54.96,46.8 arc-90 56.2,48.04 56.75,48.04 arc55 57.4,48.38 arc-98 58.54,48.49 arc24 58.91,48.27 59.97,48.02 arc90 61.27,49.33 61.27,49.99 arc90 C69.2
AD9523_OUT4_N
  Top 0.204: IC1.52 61.42,43.92 61.44,43.94 67.61,43.94 arc45 69.73,44.82 71.07,46.16 arc-45 72.85,46.9 78,46.9 arc-45 78.7,46.61 J3.2
AD9523_OUT4_P
  Top 0.204: IC1.53 61.42,44.43 61.44,44.41 67.61,44.41 arc45 69.4,45.15 70.74,46.49 arc-45 72.85,47.36 78.03,47.36 arc45 J3.1
AD9523_OUT5_N
  Top 0.204: IC1.49 61.42,42.42 61.42,42.45 69.05,42.45 arc-45 70.77,41.73 72.23,40.27 arc45 74.36,39.39 77.89,39.39 arc-45 J4.2
AD9523_OUT5_P
  Top 0.204: IC1.50 61.42,42.93 61.42,42.91 69.05,42.91 arc-45 71.09,42.06 72.56,40.59 arc45 74.36,39.85 77.9,39.85 arc45 J4.1
AD9523_OUT6+
  Top 0.22: C15.2 92.67,30.16 arc90 J7.1
AD9523_OUT6_DRV
  Top 0.22: IC1.47 62.91,41.43 arc-90 R39.1
AD9523_OUT6_SER
  Top 0.204: R39.2 65.37,41.38 arc-90 67.9,38.85 67.9,32.71 arc90 70.45,30.16 C15.1
AD9523_OUT7+
  Top 0.204: IC1.44 62.73,39.91 arc-90 66.48,36.16 66.48,31.55 arc90 70.58,27.45 73.1,27.45 arc-90 75.64,24.91 75.64,18.82 arc90 78.18,16.28 J8.1
AD9523_OUT8_N  (via drill 0.15)
  Top 0.204: C70.2 59.81,49.19 59.73,49.19 59.73,48.95 v59.81,48.95 | v63.52,37.84 63.52,37.91 60.62,37.91 arc-90 IC1.40
  Bottom 0.204: v59.81,48.95 59.81,48.58 arc90 60.81,47.58 67.62,47.58 arc-90 69.09,46.11 arc90 69.52,45.68 70.8,45.68 arc-90 71.69,44.79 71.69,44.58 arc-90 70.8,43.69 67.2,43.69 arc90 66.78,43.26 66.78,43.05 arc90 67.2,42.62 70.8,42.62 arc-90 71.69,41.73 71.69,41.52 arc-90 70.8,40.63 69.52,40.63 arc90 69.09,40.2 69.09,39.38 arc-90 67.62,37.91 63.52,37.91 v63.52,37.84
AD9523_OUT8_P  (via drill 0.15)
  Top 0.204: C71.2 59.19,49.19 59.27,49.19 59.27,48.95 v59.2,48.95 | v63.52,38.45 63.52,38.38 60.64,38.38 arc-90 IC1.41
  Bottom 0.204: v59.2,48.95 59.2,48.58 arc90 60.66,47.11 67.62,47.11 arc-90 68.62,46.11 arc90 69.52,45.22 70.8,45.22 arc-90 71.22,44.79 71.22,44.58 arc-90 70.8,44.16 66.92,44.16 arc90 66.03,43.26 66.03,43.05 arc90 66.92,42.16 70.8,42.16 arc-90 71.22,41.73 71.22,41.52 arc-90 70.8,41.1 69.52,41.1 arc90 68.62,40.2 68.62,39.38 arc-90 67.62,38.38 63.52,38.38 v63.52,38.45
AD9523_OUT9_N  (via drill 0.15)
  Top 0.204: IC1.37 61.42,36.43 61.43,36.44 62.84,36.44 arc-90 63.38,35.9 v63.38,35.3 | v45.32,46.9 45.25,46.97 arc-7 45.35,48.65 45.35,49.07 arc-90 45.35,49.08 45.35,50.05 arc-90 C13.2
  Bottom 0.204: v45.32,46.9 45.25,46.9 45.25,35.97 arc90 47.79,33.42 61.58,33.42 arc90 63.45,35.3 v63.38,35.3
AD9523_OUT9_P  (via drill 0.15)
  Top 0.204: IC1.38 62.32,36.91 arc-90 62.33,36.91 62.83,36.91 arc-90 63.99,35.75 v63.99,35.3 | C14.2 arc90 44.79,50.07 arc-90 44.89,49.96 44.89,48.7 arc7 44.79,46.97 v44.71,46.9
  Bottom 0.204: v44.71,46.9 44.79,46.9 44.79,35.97 arc90 47.79,32.96 61.58,32.96 arc90 63.91,35.3 v63.99,35.3
AD9523_OUT10+
  Top 0.204: IC1.35 R40.1
  Top 0.22: R40.1 arc-90 R40.1
AD9523_OUT10_SER
  Top 0.204: R40.2 59.45,31.01 arc90 60.94,29.52 61.04,29.52 arc-90 64.58,25.98 C17.1
AD9523_OUT11+
  Top 0.204: IC1.32 R41.1
  Top 0.22: R41.1 arc90 R41.1
AD9523_OUT11_SER
  Top 0.204: R41.2 57.97,31.04 arc-90 56.4,29.47 55.5,29.47 arc90 52.88,26.85 52.88,25.11 arc-90 C19.1
AD9523_PD  (via drill 0.15)
  Top 0.15: IC1.15 49.73,37.93 46.8,35 46.8,32.15 v47.4,31.55
  Route14 0.15: v47.4,31.55 47.4,25.85 40.22,18.67 JP1.1
AD9523_REF_SEL  (via drill 0.15)
  Top 0.15: IC1.16 49.77,37.42 v49.25,36.9
  Route14 0.15: JP1.2 40.28,16.13 49.25,25.1 v49.25,36.9
AD9523_RESET  (via drill 0.15)
  Top 0.15: IC1.19 51.46,31.01 43.7,23.25 43.7,12.7 43,12 27.4,12 26.75,12.65 v26.75,13.55
  Route3 0.15: v26.75,13.55 19.65,13.55 18.9,14.3 JP1.4
AD9523_SCLK
  Top 0.2: JP1.6 16.36,13.64 R6.1
AD9523_SDIO
  Top 0.2: R8.1 13.86,18.71 JP1.7
AD9523_SDO
  Top 0.15: IC1.23 53.44,30.34 46.3,23.2 46.3,11.75 44.3,9.75 15.95,9.75 13.82,11.88 JP1.8
AD9523_STATUS0  (via drill 0.15)
  Top 0.15: IC1.56 59.46,46.54 v59.1,46.9
  Bottom 0.15: v59.1,46.9 58.75,47.25 47.45,47.25 45.75,48.95 39.75,48.95 19.7,28.9 17.3,28.9 11.28,22.88 JP1.9
AD9523_STATUS1  (via drill 0.15)
  Top 0.15: 59.9,45.61 IC1.55 59.94,46.26 v59.9,46.3 | v14.65,4.7 11.28,8.07 JP1.10
  Bottom 0.15: v59.9,46.3 59.15,45.55 51.05,45.55 50.1,46.5 46.85,46.5 45.7,47.65 41.95,47.65 24.85,30.55 24.85,8.2 21.35,4.7 v14.65,4.7
AD9523_SYNC  (via drill 0.15)
  Top 0.15: IC1.17 49.96,36.91 48.17,35.12 v47.77,35.12 47.75,35.1
  Route14 0.15: JP1.3 18.9,26.75 27.3,35.15 47.77,35.15 v47.77,35.12
ADF4382_RX_CE  (via drill 0.15)
  Top 0.22: U6.31 v57.05,54.87 R38.1
  Bottom 0.1: v57.05,54.87 57.05,54.9 59.15,54.9 59.5,55.25 74,55.25 87.25,68.5 JP2.10
ADF4382_RX_CS  (via drill 0.15)
  Top 0.22: R37.1 v57.35,54.41 58.21,54.41 U6.32
  Bottom 0.1: JP2.9 88.9,67.6 87.6,67.6 75.05,55.05 60.65,55.05 60.25,54.65 60.25,54.5 59.75,54 59.35,54 58.95,54.4 v57.35,54.4 v57.35,54.41
ADF4382_RX_DELADJ  (via drill 0.15)
  Top 0.22: U6.28 v57.55,56.37 57.02,56.37 R35.2
  Bottom 0.1: v57.55,56.37 57.55,56.75 57.25,57.05 57.25,57.35 57.45,57.55 59.25,57.55 65.65,63.95 80.15,63.95 87.25,71.05 JP2.12
ADF4382_RX_DELSTR  (via drill 0.15)
  Top 0.15: R36.2 55.88,55.87 v56.9,55.87 U6.29
  Route14 0.1: v56.9,55.87 56.9,55.2 56.65,54.95 56.65,53.1 56.55,53 56.55,52.7 57.1,52.15 63,52.15 65.1,54.25 65.1,54.55 67.4,56.85 90.2,56.85 91.4,58.05 91.4,69.5 89.85,71.05 JP2.11
ADF4382_RX_LKDET  (via drill 0.15)
  Top 0.22: U6.27 57.93,56.87 v57.6,57.2 57.4,57.4 56.9,57.4 56.82,57.48 R34.2
  Bottom 0.1: v57.6,57.2 58.7,57.2 59.45,56.45 73.9,56.45 | 88.55,71.35 88.55,72.35 89.8,73.6 JP2.13
  Bottom 0.152: 73.9,56.45 86.15,68.7 86.15,69.2 86.6,69.65 88,69.65 88.05,69.6 88.55,70.1 88.55,71.35
ADF4382_RX_SYNC_N
  Top 0.204: U6.39 R26.2 arc-90 59.81,51.07 C70.1
ADF4382_RX_SYNC_P
  Top 0.204: U6.38 59.23,51.17 arc-90 R26.1 59.22,50.3 arc-90 C71.1
ADF4382_SCLK  (via drill 0.15)
  Top 0.15: U1.34 43.22,53.37 v43.2,53.35 | U6.34 57.52,53.37 v57.4,53.25
  Route14 0.1: v57.4,53.25 57.85,53.7 57.85,55.4 56.8,56.45 50.3,56.45 48.5,58.25 43.1,58.25 42.35,57.5 42.35,54.2 v43.2,53.35
  Bottom 0.1: v57.4,53.25 57.4,52.85 57.05,52.5 56.75,52.5 56.55,52.7 56.1,52.7 55.9,52.5 55.9,50.8 56.9,49.8 57.6,49.8 59.4,51.6 62.85,51.6 63.25,51.2 83.8,51.2 87.65,55.05 91.7,55.05 95.6,58.95 95.6,59.25 92.75,62.1 89.25,62.1 88.55,61.4 88.55,60.55 87.3,59.3 87.3,58.4 JP2.2
ADF4382_SDIO  (via drill 0.15)
  Top 0.15: U1.33 arc-90 43.87,53.85 v43.2,53.85 | v57.5,53.9 57.53,53.87 U6.33
  Bottom 0.15: v43.2,53.85 49.4,53.85 51.75,56.2 54.15,56.2 55.45,54.9 55.45,53.9 55.4,53.85 55.73,53.52 57.12,53.52 57.27,53.67 | 57.27,53.67 v57.5,53.9 | 57.27,53.67 59.08,53.67 59.15,53.75 64.15,53.75 64.15,54.25 64.7,54.8 66.95,54.8 67.35,54.4 85.4,54.4 86.85,55.85 91.85,55.85 94.45,58.45 94.45,59.45 93,60.9 JP2.3
ADF4382_SDO  (via drill 0.15)
  Top 0.15: U1.35 43.12,52.87 v43.1,52.85 | U6.35 56.92,52.87 v56.9,52.85
  Route14 0.1: v56.9,52.85 57.5,52.85 58.4,53.75 63.5,53.75 67.5,57.75 74.25,57.75 76.2,59.7 88.05,59.7 89.35,58.4 89.8,58.4 JP2.1
  Bottom 0.1: v43.1,52.85 44.85,52.85 45.7,52 55.1,52 56,52.9 56.85,52.9 v56.9,52.85
ADF4382_TX_CE  (via drill 0.15)
  Top 0.22: U1.31 v42.95,54.87 41.41,54.87 R25.1
  Bottom 0.1: v42.95,54.87 42.95,54.9 44.8,54.9 45.2,55.3 50.5,55.3 59.35,64.15 76,64.15 87,75.15 90.45,75.15 91.5,74.1 91.5,68.4 90.4,67.3 89.4,67.3 88.65,66.55 88.65,64.6 89.8,63.45 JP2.5
ADF4382_TX_CS  (via drill 0.15)
  Top 0.22: R24.1 v43,54.34 43.87,54.34 U1.32
  Route14 0.1: JP2.4 76.55,60.9 74.15,58.5 43.05,58.5 42.15,57.6 42.15,52.7 42.9,51.95 43.2,51.95 43.55,52.3 43.55,54 43.25,54.3 43,54.3 v43,54.34
ADF4382_TX_DELADJ  (via drill 0.15)
  Top 0.22: U1.28 v43.2,56.37 41.84,56.37 R22.2
  Bottom 0.1: 54.77,67.52 43.65,56.4 43.2,56.4 v43.2,56.37 | 80.8,70.4 86,75.6 91.2,75.6 91.9,74.9 91.9,68.05 89.85,66 JP2.7
  Bottom 0.15: 80.8,70.4 75.3,64.9 72.15,64.9 66.75,70.3 65.9,70.3 63.12,67.52 54.77,67.52
ADF4382_TX_DELSTR  (via drill 0.15)
  Top 0.22: U1.29 43.78,55.98 v42.7,55.98 R23.2
  Bottom 0.1: v42.7,55.98 42.7,55.75 42.55,55.6 42.55,52.3 45.25,49.6 58.05,49.6 59.35,50.9 85.55,50.9 89.2,54.55 92.4,54.55 96.25,58.4 96.25,59.3 93.05,62.5 88.2,62.5 87.3,63.4 JP2.6
ADF4382_TX_LKDET  (via drill 0.15)
  Top 0.22: U1.27 v43.2,56.87 42.58,56.87 R21.2
  Route14 0.1: JP2.8 88.6,67.3 88.6,71.85 89.1,72.35 90.65,72.35 91.95,71.05 91.95,57.7 90.7,56.45 80.65,56.45 76.15,51.95 55.75,51.95 52.65,55.05 45.3,55.05 43.5,56.85 43.2,56.85 v43.2,56.87
ADF4382_TX_SYNC_N
  Top 0.204: U1.39 R13.2 | R13.2 arc-90 R13.2 | C13.1 arc-90 45.37,50.63 R13.2
ADF4382_TX_SYNC_P
  Top 0.204: U1.38 44.87,51.09 arc-90 R13.1 arc90 44.82,51.03 C14.1
GND  (via drill 0.15, 0.2, 0.2 pad 0.45, 0.3, 0.5, 1, 2)
  Top 0.152: U2.13 v45.56,64.65 v45.55,64.65 | U3.13 52.58,64.05 v52.55,64.05 | U7.13 v59.85,65.35 | U9.13 68.48,65.62 v68.5,65.6 | U6.50 62.79,56.44 v63.35,57 | U6.49 63.28,54.3 v63.3,54.3 | U6.51 60.17,56.37 v59.6,55.8 | U1.50 v48.95,56.95 | U1.49 48.85,53.39 v48.85,53.25 | U1.51 45.27,55.9 v45.2,55.9 | U1.52 45.84,53.81 v46.4,53.25 | IC1.73 55.7,40.65 v55.65,40.6
  Top 0.2: C24.2 v62.8,37.42 | R3.1 7.38,60.68 v7.4,60.7 | C2.2 v31.99,12.96 v32,12.95 | R7.2 16.37,11.42 v16.35,11.4 | R9.2 13.82,23.72 v13.85,23.75 | R11.2 16.42,23.72 v16.45,23.75
  Top 0.22: C5.1 v48.71,42.39 | 49.25,41.9 v48.7,41.9 | C9.1 48.72,37.6 v47.65,37.6 | U1.1 51.08,52.37 v51.1,52.35 | U1.2 50.37,52.85 v51.1,52.85 51.62,52.85 C50.2 | U1.4 50.37,53.85 v51.05,53.85 51.12,53.92 C58.2 | C60.2 53.35,54.85 v53.4,54.8 | C61.2 v53.91,51.56 v53.9,51.55 | C62.2 50.28,50.37 v50.3,50.35 | v50,51.3 49.87,51.43 U1.48 | U1.10 51.08,56.87 v51.1,56.85 | U1.12 51.08,57.87 v51.1,57.85 C57.2 | U1.14 49.37,58.67 50,59.3 v51.14,59.3 51.28,59.44 C56.2 | C1.2 48.35,60.18 v48.35,60.5 | U1.16 arc-45 48.4,58.27 v48.4,57.85 | U1.18 arc-45 47.4,58.27 v47.4,57.9 | U1.19 arc-45 46.9,58.27 v46.9,57.9 | C63.2 45.84,61.58 arc-45 v45.85,61.6 | v45.85,57.85 45.85,58.3 arc-45 U1.21 | U1.23 arc45 44.56,59.09 v44.55,59.1 arc-45 44.46,59.32 C55.2 | U1.25 43.87,57.85 v43.2,57.85 | U1.26 43.23,57.37 v43.2,57.4 | D1.C 41.7,60.81 v41.7,61.95 | v41.25,56.95 R22.1 | v40.65,55.45 40.67,55.48 R23.1 41.95,55.48 C38.2 | C39.2 v42.56,51.41 v42.55,51.4 | U1.41 46.37,51.02 v46.35,51 C40.2 | v48.35,51.2 v48.36,51.19 C48.2 C49.2 | C59.1 v49.65,48.95 | U6.1 65.37,52.37 arc90 v65.5,52.5 | U6.2 64.79,52.95 v65.5,52.95 C72.2 | U6.4 64.73,53.85 v65.45,53.85 65.51,53.91 C73.2 | v68.1,55.85 C83.2 | C84.2 v68.7,55.6 | U6.10 64.69,56.85 v64.25,56.85 | U6.12 64.73,57.85 v65.5,57.85 C74.2 | U6.14 63.73,58.58 63.95,58.8 63.95,59.1 v64.15,59.3 64.15,59.51 C75.2 | v62.7,57.85 62.7,58.27 arc-45 U6.16 | v62.75,60.55 62.75,60.28 arc-45 C89.2 | v61.75,57.85 arc-45 61.73,57.9 U6.18 | v61.2,57.85 61.2,58.27 arc-45 U6.19 | C86.2 v60.2,62 | v60.2,57.85 60.2,58.32 U6.21 | U6.23 59.23,59.02 59.15,59.1 v58.65,59.1 58.65,59.31 C76.2 | v57.55,57.9 57.58,57.87 U6.25 U6.26
  Top 0.22: D2.C 56.83,62.52 v56.75,62.6 | R35.1 56.92,56.95 v56.45,56.95 | R36.1 v55.84,56.79 v55.85,56.8 | C77.2 56.02,55.38 v56,55.4 | C78.2 56.27,52.33 v56.25,52.35 | U6.52 60.17,53.73 v60.75,53.15 | U6.41 60.7,51.86 v60.7,51.25 60.72,51.23 C79.2 | v62.25,50.05 C80.2 | v62.7,50.05 C81.2 | C85.2 63.85,50.3 v64.2,50.3 | U6.48 65.31,51.89 v65.65,51.55 | v43.65,64.5 U2.6 | U2.10 v48.54,64.49 v48.55,64.5 | U2.3 45.05,66.45 v44.45,67.05 | U2.1 46.7,66.45 v47.2,66.95 | v47.3,68.2 47.1,68 U4.3 | v44.5,68.25 44.75,68 U4.4 | U5.3 53.59,68.65 v54.3,68.65 | U5.4 52.29,68.65 v51.55,68.65 | v51.5,66.45 52.12,65.83 U3.3 | U3.1 53.58,65.83 v54.2,66.45 | U3.10 55.53,63.87 v55.55,63.85 | v50.5,63.85 51.44,63.85 U3.6 | U8.3 v61.85,68 | U8.4 v58.6,68 | U7.1 61.22,66.95 v62,66.95 | v58.6,67.1 59.05,67.1 U7.3 | U7.10 v62.89,64.49 v62.9,64.5 | U7.6 58.72,64.45 v57.85,64.45 | U10.3 70.65,67.4 v71.05,67 | U10.4 69.2,68.73 v69.2,68.75 | U9.3 68.2,67.38 v68.2,68.3 | U9.1 69.78,65.8 v70.65,65.8 | U9.10 69.55,63.26 v69.55,63.2 | v65.65,66.95 65.86,66.95 U9.6
  Top 0.3: C16.2 49.12,44.95 v49.55,44.95 | C3.1 49.18,45.75 v48.8,45.75 | C4.1 v48.71,43.39 v48.7,43.4 | v48.71,42.39 v48.7,42.4 | C6.1 49.25,41.9 | C7.1 v48.66,40.39 v48.65,40.4 | C34.2 48.39,38.86 v48.35,38.9 | C10.1 47.92,39.42 v47.9,39.4 | v55.95,35 55.95,34.58 C20.2 | C35.2 57.46,34.96 v57.5,35 | v59,35 59,34.57 C22.2 | C36.2 v61.4,35.25 | C37.2 62.59,39.1 v63.05,39.1 | C26.2 61.35,40.9 v61.3,40.95 | C41.2 63.28,41.88 v63.3,41.9 | C28.2 v63.09,43.41 v63.1,43.4 | C42.2 61.3,45.5 v61.2,45.4 | v58,46.3 58,46.79 C30.2 | C43.2 56.85,46.69 v56.85,46.3 | C32.2 54.48,47.62 v54.45,47.65 | C44.2 52.08,46.38 v52.05,46.35 | C18.2 v49.91,34.64 v49.9,34.65
  Top 0.35: C82.1 v65.5,49.15
  Top 0.5: v36.45,13.45 36.45,16.03 X6.2 | X5.2 36.66,27.34 v38.25,25.75
  Top 2: X4.5 34.65,59.01 | C21.2 10,27.4 v10.5,26.9 | C23.2 21,27.6 v21.6,27 | C25.2 35.5,3.4 v35.5,1.4 | C27.2 v45.9,1.5 | C29.2 81.3,3.4 v81.3,1.4 | C31.2 70.5,1.7 v70.4,1.6 | v20.9,96.7 18.3,96.7 C33.2 | C45.2 16.4,85.7 v15.7,86.4 | C46.2 v34.3,90.3 | C47.2 v34.4,86.7 | C51.2 87.6,88.8 v87.6,91
  Top 4: 34.65,59.01 v34.65,64.9
  other vias: 53.2,43.2 55.6,43.15 58.1,43.2 53.2,40.45 58.2,40.6 53.35,37.9 55.9,37.85 58.3,37.8 45.15,57.05 46.4,57.05 46.55,55.85 47.8,57 49,55.85 47.8,55.85 45.15,54.5 46.4,54.45 45.25,53.2 47.8,54.4 48.9,54.45 47.85,53.3 59.55,57.1 60.8,57.05 60.75,55.8 62.1,57.05 63.4,55.9 62.2,55.85 59.55,54.55 60.8,54.45 59.6,53.2 62.2,54.35 62.25,53.15 63.3,53.2 45.55,65.35 46.25,65.35 46.25,64.65 52.55,64.75 53.3,64.75 53.3,64.05 60.65,65.35 60.65,64.6 59.85,64.6 67.9,66.1 67.95,65 67.55,65.45 60.4,49.2 45.88,46.67 44.2,46.73 46.4,42.1 48.7,36.3 47.5,34.6 14.6,4.05 57.4,50.9 77.8,52.6 45,73.92 45.32,73.1 45.32,72.3 45.32,71.5 45.32,70.7 45.32,69.9 45.32,69.1 46.54,73.1 46.54,72.3 46.54,71.5 46.54,70.7 46.54,69.9 46.54,69.1 46.83,73.92 52.23,89.53 52.33,88.7 52.33,87.9 52.33,87.1 52.33,86.3 52.33,85.5 52.33,84.7 52.33,83.9 52.33,83.1 52.33,82.3 52.33,81.5 52.33,80.7 52.33,79.9 52.33,79.1 52.33,78.3 52.33,77.5 52.33,76.7 52.33,75.9 52.33,75.1 50.98,73.45 52.33,73.5 52.33,72.7 52.33,71.9 52.33,71.1 52.33,70.3 52.33,69.5 53.55,69.5 53.55,70.3 53.55,71.1 53.55,71.9 53.55,72.7 53.55,73.5 53.55,74.3 53.55,75.1 53.55,75.9 53.55,76.7 53.55,77.5 53.55,78.3 53.55,79.1 53.55,79.9 53.55,80.7 53.55,81.5 53.55,82.3 53.55,83.1 53.55,83.9 53.55,84.7 53.55,85.5 53.55,86.3 53.55,87.1 53.55,87.9 53.55,88.7 53.67,89.52 59.59,68.7 59.59,69.5 59.59,70.3 59.59,71.1 59.59,71.9 59.59,72.7 59.59,73.5 59.42,74.37 60.81,68.7 60.81,69.5 60.81,70.3 60.81,71.1 60.81,71.9 60.81,72.7 60.81,73.5 60.94,74.39 70.25,68.85 70.82,69.42 71.38,69.98 71.95,70.55 72.51,71.11 73.08,71.68 73.64,72.24 71.11,68.01 71.68,68.58 72.24,69.14 72.81,69.71 73.37,70.27 73.94,70.84 74.67,71.28 2.39,4.47 1.39,14.47 2.39,24.47 2.39,34.47 2.39,44.47 2.39,54.47 2.39,64.47 2.39,74.47 2.39,84.47 2.39,94.47 7.39,4.47 4.89,9.47 6.24,15.42 5.74,20.12 8.19,25.02 2.64,29.72 7.39,34.47 4.89,39.47 5.89,44.07 4.89,49.47 7.39,54.47 4.89,59.47 5.34,69.42 7.39,74.47 3.64,78.87 8.14,87.52 4.89,89.47 12.39,4.47 9.89,9.47 12.39,14.47 9.54,20.52 11.59,24.82 13.79,27.92 12.59,26.87 6.24,38.17 12.39,44.47 8.59,49.47 12.39,54.47 8.84,61.27 12.39,64.47 12.39,74.47 10.79,76.37 12.44,88.47 17.54,2.72 13.34,8.52 17.39,14.47 15.24,23.72 17.39,24.47 17.19,26.47 15.03,28.34 2.34,40.52 17.39,44.47 14.89,49.47 17.39,54.47 14.89,59.47 17.39,64.47 16.64,69.57 17.39,74.47 16.99,79.52 22.39,3.67 23.34,14.52 20.59,20.57 22.39,24.47 23.24,36.72 20.99,24.97 19.89,39.47 22.39,43.42 18.24,49.42 16.79,77.07 27.39,14.47 23.09,20.22 25.79,25.42 26.09,29.32 29.14,32.97 24.89,39.47 27.34,43.27 24.89,49.47 27.44,48.57 34.64,12.72 29.94,20.47 32.64,25.32 29.89,29.47 32.44,33.77 29.04,40.47 32.04,43.52 29.89,49.47 32.29,48.77 31.94,64.52 31.89,70.17 31.89,74.17 32.39,84.47 37.39,14.47 35.09,20.47 35.44,25.77 33.04,26.02 42.54,31.47 35.74,37.82 33.74,44.92 34.89,49.47 37.24,48.77 40.09,64.87 37.14,63.02 34.89,69.47 36.49,74.12 37.34,79.52 37.39,84.47 42.39,14.47 38.34,20.52 39.94,21.57 39.89,29.47 42.39,34.47 41.29,38.82 30.39,44.77 38.59,48.92 43.14,62.92 40.19,63.07 42.39,64.47 39.89,69.47 40.89,74.37 40.84,80.02 42.39,84.47 40.79,13.97 42.29,16.37 42.14,21.77 42.63,29.67 43.29,32.77 43.99,38.62 43.89,45.07 36.84,47.62 41.59,63.17 48.79,63.02 49.69,64.47 43.19,68.97 50.94,74.42 44.94,79.02 47.39,84.47 47.39,94.47 71.18,11.34 46.88,10.49 46.05,9.48 65.47,28.38 48.84,2.21 47.09,36.67 46.79,44.87 48.74,48.97 71.49,60.57 55.69,62.92 55.89,65.02 49.49,68.92 52.39,74.47 49.89,79.47 51.19,84.52 52.39,94.47 59.19,2.27 72.92,10.68 70.31,10.05 66.45,23.72 65.97,26.03 70.3,24.24 42.94,37.27 42.79,39.42 55.29,49.02 62.69,62.97 56.64,64.32 55.49,68.82 55.04,74.37 54.89,79.47 57.39,84.47 62.64,89.42 57.44,94.97 71.17,9.09 65.88,27.18 65.23,30.49 62.39,34.47 66.39,39.57 75.34,43.37 71.84,53.07 71.44,61.87 63.89,64.82 58.34,68.92 65.14,74.42 60.39,79.77 62.39,84.47 60.54,89.47 62.39,94.47 70.24,21.62 67.39,24.47 65.18,29.47 72.24,32.57 65.29,40.12 72.44,43.17 66.69,48.87 66.99,53.57 64.29,65.87 65.29,68.37 68.14,74.52 64.79,79.02 64.89,89.47 67.39,94.47 72.39,14.47 72.19,20.67 72.39,24.47 79.94,23.22 72.39,34.47 72.11,37.4 72.39,44.47 72.29,49.37 73.04,53.52 71.64,59.52 70.69,64.82 69.14,69.92 70.44,75.22 69.89,79.47 72.39,94.47 77.39,14.47 73.39,17.52 77.39,24.47 76.89,28.12 77.39,34.47 74.59,36.47 85.34,45.32 74.89,49.47 77.39,55.22 74.04,59.52 77.89,64.87 76.69,68.67 78.59,74.97 74.19,79.02 77.39,94.47 82.39,14.47 79.89,19.47 82.39,24.47 85.04,23.02 82.39,34.47 81.79,39.32 82.39,44.47 82.54,49.57 82.24,55.17 79.19,57.72 79.54,64.77 79.04,69.57 82.39,74.47 82.39,94.47 84.89,19.47 87.39,24.47 79.59,27.07 87.39,34.47 84.34,39.17 87.39,44.47 86.34,50.47 87.49,53.97 81.44,57.67 77.54,62.52 84.89,69.47 87.39,94.47 92.39,24.47 89.99,24.22 92.44,35.27 89.94,39.12 92.39,44.47 87.69,50.37 94.04,54.52 92.99,59.67 93.14,64.47 92.99,69.72 92.64,74.62 92.39,94.47 97.39,4.47 94.89,9.47 99.04,13.72 97.39,24.47 98.24,29.52 98.14,34.67 94.89,39.12 97.39,44.47 98.59,49.37 97.39,54.47 97.19,59.42 97.39,64.47 95.39,69.82 97.39,74.72 97.39,94.47 13.09,78.22 11.47,77.35 9.64,77.09 7.84,77.46 6.27,78.43 4.93,79.93 4.55,81.63 4.61,83.47 5.29,85.18 6.52,86.56 6.05,87.68 9.97,87.69 11.77,87.32 13.34,86.35 14.48,84.9 14.32,79.6 49.84,94.72 48.09,92.72 47.89,90.32 47.79,88.22 47.99,85.82 49.49,84.67 55.14,84.37 57.84,87.12 57.84,89.67 57.89,91.27 54.94,94.97 52.54,95.77 57.99,85.22 7.54,72.92 9.94,72.82 12.54,72.92 15.69,72.77 16.74,71.17 16.84,65.67 16.74,62.92 13.94,62.87 11.39,62.87 8.49,62.82 6.84,64.52 6.79,66.27 6.89,68.87 6.74,71.02 40.89,72.27 40.79,70.02 48.09,68.97 41.99,68.82 50.84,70.02 50.89,71.47 51.04,76.07 50.94,77.82 49.04,78.82 47.04,78.87 42.44,78.87 40.89,78.07 40.89,76.12 55.09,76.72 55.04,71.67 56.79,68.82 62.34,68.92 65.14,70.67 65.24,72.62 65.24,76.42 61.74,78.87 57.79,78.97 55.34,78.77 77.44,68.17 76.09,66.62 73.49,65.92 72.34,67.02 68.29,70.87 68.39,73.32 71.59,76.82 75.84,77.62 81.14,71.57 52.89,2.42 54.24,2.47 55.64,2.42 57.39,1.67 60.04,2.27 62.64,2.52 64.24,2.52 65.94,2.47 67.69,1.82 50.28,2.31 47.34,11.82 47.34,14.32 47.34,16.82 47.34,19.32 47.34,21.82 47.89,23.02 47.89,28.37 47.94,29.37 48.04,30.82 47.89,32.17 68.04,13.82 66.34,13.82 65.24,13.77 65.09,15.57 65.29,31.57 65.14,33.82 65.24,36.12 70.04,59.77 68.44,59.42 54.69,61.52 54.24,60.82 50.3,35.15 60.7,35.35 61.48,39.4 26.5,88.4 25,86.4 70.9,88.3 69.07,11.73 48.93,11.61 62.85,35.33 64.53,35.25 63.45,37.33 63.53,38.95 58.63,49.08
  pour Route2: 0,100 100,100 100,0 0,0
  pour Route15: 0,100 100,100 100,0 0,0
N$1
  Top 0.2: X4.1 11.29,58.81 R2.1 7.38,58.83 R3.2
N$2
  Top 0.2: X6.1 31.33,14.36 R4.1 31.52,13.55 C2.1
N$3
  Top 0.3: IC1.1 49.99,45.72 C3.2
N$4
  Top 0.22: C6.2 IC1.7
N$5
  Top 0.3: C4.2 49.75,43.41 IC1.4
N$6
  Top 0.22: C5.2 49.8,42.42 IC1.6
N$7
  Top 0.3: IC1.10 50.77,40.39 C7.2
N$8
  Top 0.3: C8.2 50.76,39.87 IC1.11
N$9
  Top 0.22: R5.1 47.59,38.16 47.25,38.5 47.25,39.55 47.57,39.87 C8.1
N$10
  Top 0.22: IC1.14 50.74,38.35 49.91,38.35 49.82,38.27 48.88,38.27 C9.2 48.74,38.16 R5.2
N$11
  Top 0.22: C10.2 49.28,39.42 49.3,39.44 49.82,39.44 49.83,39.42 IC1.12
N$12
  Top 0.15: IC1.21 52.45,30.55 45.15,23.25 45.15,12.6 43.55,11 19.8,11 17.6,13.2 16.46,13.2 R6.2
  Top 0.2: R7.1 R6.2
N$13
  Top 0.15: IC1.22 52.96,30.46 45.8,23.3 45.8,12.2 44,10.4 16.25,10.4 15.05,11.6 15.05,21.35 14.64,21.75 R8.2
  Top 0.2: R8.2 13.86,22.39 R9.1
N$14
  Top 0.15: IC1.20 51.94,30.84 44.45,23.35 44.45,12.75 43.2,11.5 27.15,11.5 25.75,12.9 25.75,19.4 22.7,22.45 R11.1 16.36,22.39
  Top 0.2: R10.2 16.36,22.39 R11.1
N$15
  Top 0.22: U1.43 R12.2 arc-90 R12.2 C11.1
N$16
  Top 0.22: U1.42 46.87,51.09 arc-90 R12.1 arc90 46.81,51.02 C12.1
N$17
  Top 0.22: R18.2 53.38,52.07 C61.1
N$18
  Top 0.22: 51.69,56.37 R14.1
  Top 0.35: U1.9 51.69,56.37
N$19
  Top 0.22: 51.7,55.87 R14.2
  Top 0.35: U1.8 51.7,55.87 | R14.2 52.69,55.91 FB2.2
N$20
  Top 0.35: FB3.1 51.09,49.82 C59.2 49.43,49.82 48.87,50.38 U1.46
N$21
  Top 0.22: R19.1 R20.2
N$22
  Top 0.22: U1.7 51.38,55.37 R15.1
N$23
  Top 0.22: R15.2 52.22,54.02 R16.2
N$24
  Top 0.22: C60.1 53.03,54.27 R16.1 53.03,53.13 53,53.1 R17.2
N$25
  Top 0.22: R17.1 52.48,52.09 R18.1 52.45,51.47 R19.2
N$26
  Top 0.22: R20.1 C62.1 49.68,50.87 49.37,51.18 U1.47
N$27
  Top 0.204: U4.1 U2.2
N$28
  Top 0.204: U2.7 45.4,61.86 arc-45 C65.2
N$30
  Top 0.204: J10.1 45.91,70.52 U4.2
N$31
  Top 0.204: U2.9 46.42,61.62 arc45 C64.2
N$32
  Top 0.204: C67.2 arc-90 48.43,60.96 50.51,60.96 arc90 52.4,62.85 U3.7
N$33
  Top 0.204: U3.9 53.42,62.18 arc-90 51.43,60.19 C66.2
N$34
  Top 0.204: U5.1 52.94,65.86 arc-90 U3.2
N$35
  Top 0.204: U5.2 52.94,84.86 52.94,85.02 | 52.94,85.02 | J1.1 52.94,85.02
N$36
  Top 0.22: R21.1 41.75,58.2 D1.A
N$37
  Top 0.204: J9.1 26.28,82.37 arc-90 38.38,70.27 38.38,52.54 arc90 41.22,49.7 42.18,49.7 arc90 U1.37
N$38
  Top 0.22: C68.1 61.74,51.09 arc90 R1.2 U6.43 arc-90 U6.43
N$39
  Top 0.22: C69.1 61.19,51.09 arc-90 R1.1 61.22,51.88 arc-90 U6.42
N$40
  Top 0.35: R27.1 65.44,56.37 U6.9
N$41
  Top 0.35: FB1.2 66.44,56.87 R27.2 66.12,56.02 65.95,55.85 64.73,55.85 U6.8
N$42
  Top 0.22: 64.53,49.12 C82.2
  Top 0.35: 64.53,49.12 FB4.1 63.23,49.35 U6.46
N$43
  Top 0.22: R31.2 68.7,54.28 C84.1
N$44
  Top 0.22: R32.1 R33.2
N$45
  Top 0.22: U6.7 65.62,55.37 R28.1
N$46
  Top 0.22: R28.2 66.66,55.35 R29.2
N$47
  Top 0.22: R29.1 C83.1 R30.2
N$48
  Top 0.22: R30.1 67.95,54.26 | 67.95,54.26 R31.1 | R32.2 66.7,50.9 67.95,52.15 67.95,54.26
N$49
  Top 0.22: U6.47 C85.1 64.28,50.91 R33.1
N$50
  Top 0.22: R34.1 D2.A
N$51  (via drill 0.15)
  Top 0.204: J2.1 85.05,49.36 arc-90 83.42,50.99 arc90 82.36,52.05 v77.21,52.05 v77.21,52.04 | v57.47,50.15 arc90 58.73,51.41 U6.37
  Bottom 0.204: v77.21,52.04 57.16,52.04 arc90 56.33,51.21 arc90 57.4,50.14 v57.46,50.14 arc90 v57.47,50.15
N$52
  Top 0.204: U7.7 59.7,61.88 arc-45 C88.2
N$53
  Top 0.204: U7.9 60.72,61.79 arc45 C87.2
N$54
  Top 0.204: U7.2 U8.1
N$55
  Top 0.204: J11.1 U8.2
N$56
  Top 0.204: C91.2 arc-45 62.14,60.57 U9.7
N$57
  Top 0.204: C90.2 63.47,60.46 U9.9
N$58
  Top 0.204: U9.2 arc-45 68.96,66.71 U10.1
N$59
  Top 0.204: U10.2 74.12,71.87 arc-45 J12.1
N$60
  Top 0.204: IC1.72 arc90 50.58,46.45 46.75,46.45 arc90 46.6,46.3 arc-90 46.4,46.1 21.64,46.1 arc-90 20.35,47.39 20.35,65.38 arc90 17.81,67.92 C92.1
N$61
  Top 0.22: C92.2 J13.1 arc90 J13.1
N$64
  Top 0.204: C17.2 64.58,18.2 arc-90 J5.1
N$67
  Top 0.204: C19.2 52.79,23.72 J6.1
N$69
  Top 2: X10.1 4.83,32 C21.1 12.8,32 L9.2
N$71
  Top 2: X11.1 28.13,6.53 29.4,7.8 33.9,7.8 C25.1 38.2,6.3 L10.2
N$73
  Top 2: X12.1 84.33,6.3 C29.1 L11.2
N$75
  Top 2: X13.1 15.17,93.7 C33.1 22,93.7 L12.2
N$77
  Top 2: L13.2 C46.1 34.3,97.3 35.6,98.6 42.5,98.6 43.37,97.73 X14.1
OSC_CTRL  (via drill 0.15, 0.3)
  Top 0.15: IC1.8 46.48,41.43 v46.45,41.4 | v34.2,14.35 34.01,14.16 R4.2
  Route3 0.15: v46.45,41.4 41.4,41.4 34.2,34.2 v34.2,14.35
RX_RFOUT_1_N
  Top 0.204: C87.1 arc-45 60.95,60.74 L5.2 60.95,59.48 arc-45 60.85,59.25 arc45 60.73,58.96 U6.20
RX_RFOUT_1_P
  Top 0.204: C88.1 arc-45 59.49,60.62 L6.1 59.49,59.72 arc45 59.65,59.35 arc-45 59.73,59.16 U6.22
RX_RFOUT_2_N
  Top 0.204: C90.1 arc45 63.45,59.6 L7.2 arc45 63.23,58.79 U6.15
RX_RFOUT_2_P
  Top 0.204: C91.1 arc-45 61.99,59.6 L8.1 arc-45 62.23,58.74 U6.17
TX_RFOUT_1_N
  Top 0.204: C64.1 46.57,60.41 arc-45 L2.2 46.56,59.51 arc-45 46.5,59.35 arc45 46.37,59.04 U1.20
TX_RFOUT_1_P
  Top 0.204: C65.1 45.15,60.44 arc45 L3.1 45.16,59.68 arc45 45.3,59.35 arc-45 45.37,59.18 U1.22
TX_RFOUT_2_N
  Top 0.204: C66.1 49.11,59.4 arc-45 L1.2 arc45 48.87,58.83 U1.15
TX_RFOUT_2_P
  Top 0.204: C67.1 arc-45 47.67,59.65 L4.1 arc-45 47.87,58.85 U1.17
VCXO_OUT
  Top 0.204: X6.3 40.23,23.87 arc90 45.82,29.46 45.82,38.37 arc-90 48.36,40.91 50.78,40.91 arc90 IC1.9

## Text on the board
tDocu: +3V3_LO_1 | +3V3_LO_2 | GND | GND | GND | AUX. LO TX | AUX. LO RX | LO TX | LO RX | TX_LO / MUXOUT | +5V0_LO | ADF4382 | RX_LKDET | GND | RX_DELSTR | RX_CS | TX_DELADJ | RX_DELADJ | RX_CE | TX_CE | AD9523 / PLL_OUT | TX_LKDET | SDIO | TX_DELSTR | TX_CS | SDO | SCLK | ADC | FPGA / =ADC | RX_LO / MUXOUT | +3V3_XO | GND | EEPROM_SEL | FPGA SYS. / CLOCK | STATUS0 | SDIO | TEST | CS | SYNC | PD | STATUS1 | SDO | SCLK | FPGA / =DAC | DAC | GND | RESET | REF_SEL | AD9523 | GND | +3V3_CLOCK | GND | +1V8_CLOCK